# Altium project standos_RPi_com.PrjPcb
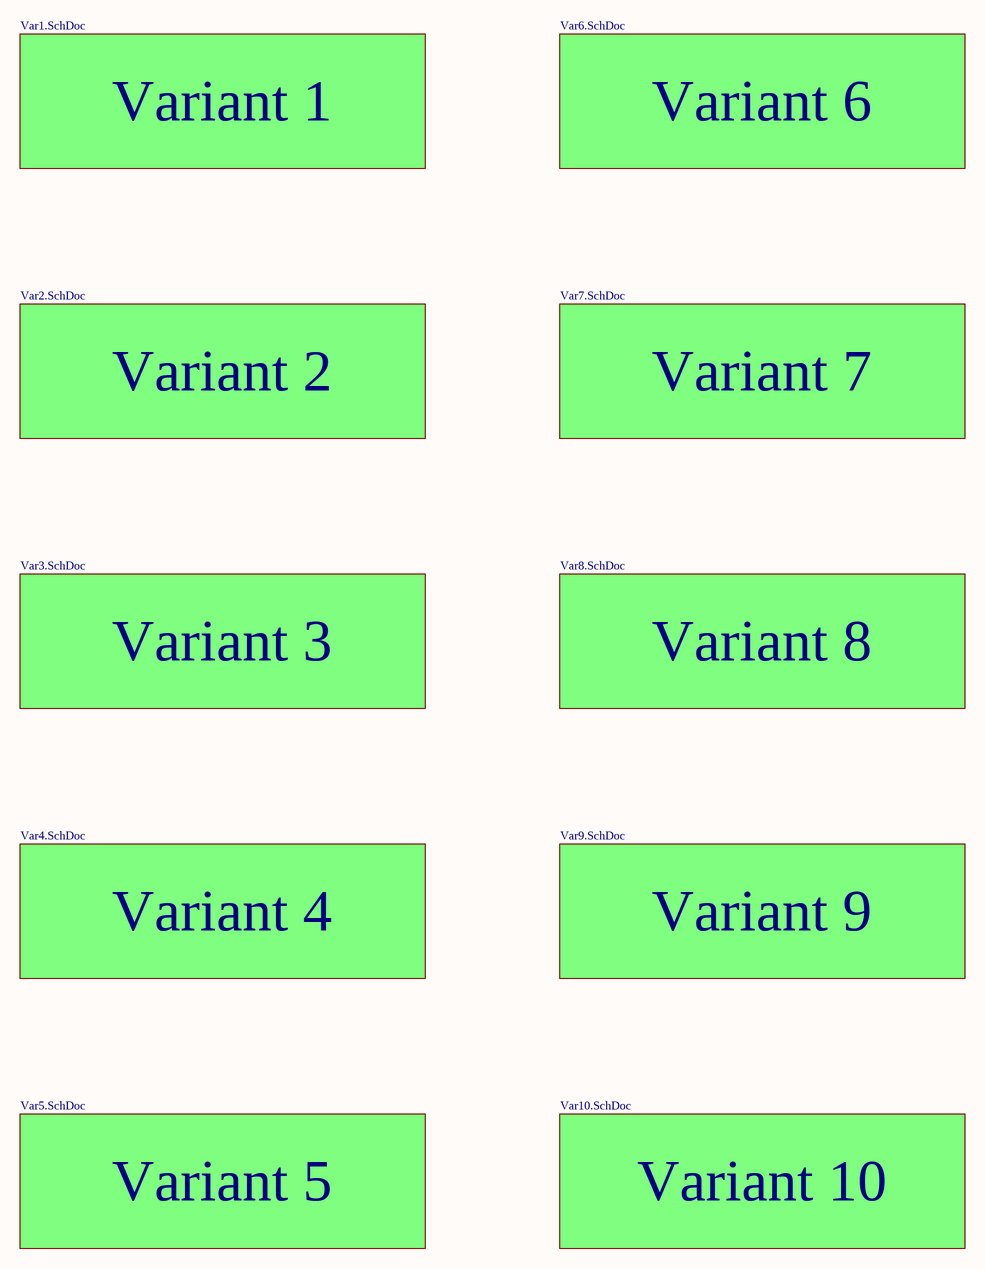
[diagram p0: Comnunication.SchDoc]
13 sheets, 32 parts. Net scope: flat (ports and power ports of the same name join across sheets).
Board file: standos_rpi_com.PcbDoc
Sheets:
  Comnunication.SchDoc
    Variant 1 = Var1.SchDoc
      Perph = Perph_connectors.SchDoc
      RPiCONN = RPi_connector.SchDoc
    Variant 2 = Var2.SchDoc
      RPiCONN = RPi_connector.SchDoc
      Perph = Perph_connectors.SchDoc
    Variant 3 = Var3.SchDoc
      RPiCONN = RPi_connector.SchDoc
      Perph = Perph_connectors.SchDoc
    Variant 4 = Var4.SchDoc
      RPiCONN = RPi_connector.SchDoc
      Perph = Perph_connectors.SchDoc
    Variant 5 = Var5.SchDoc
      RPiCONN = RPi_connector.SchDoc
      Perph = Perph_connectors.SchDoc
    Variant 6 = Var6.SchDoc
      RPiCONN = RPi_connector.SchDoc
      Perph = Perph_connectors.SchDoc
    Variant 7 = Var7.SchDoc
      RPiCONN = RPi_connector.SchDoc
      Perph = Perph_connectors.SchDoc
    Variant 8 = Var8.SchDoc
      RPiCONN = RPi_connector.SchDoc
      Perph = Perph_connectors.SchDoc
    Variant 9 = Var9.SchDoc
      RPiCONN = RPi_connector.SchDoc
      Perph = Perph_connectors.SchDoc
    Variant 10 = Var10.SchDoc
      RPiCONN = RPi_connector.SchDoc
      Perph = Perph_connectors.SchDoc

## Sheet Comnunication.SchDoc
size A3; SheetNumber: 1; SheetTotal: 13

### Sub-sheets
Variant 1 = Var1.SchDoc: no entries
Variant 2 = Var2.SchDoc: no entries
Variant 3 = Var3.SchDoc: no entries
Variant 4 = Var4.SchDoc: no entries
Variant 5 = Var5.SchDoc: no entries
Variant 6 = Var6.SchDoc: no entries
Variant 7 = Var7.SchDoc: no entries
Variant 8 = Var8.SchDoc: no entries
Variant 9 = Var9.SchDoc: no entries
Variant 10 = Var10.SchDoc: no entries

## Sheet Var1.SchDoc
size A4; SheetNumber: 2; SheetTotal: 12
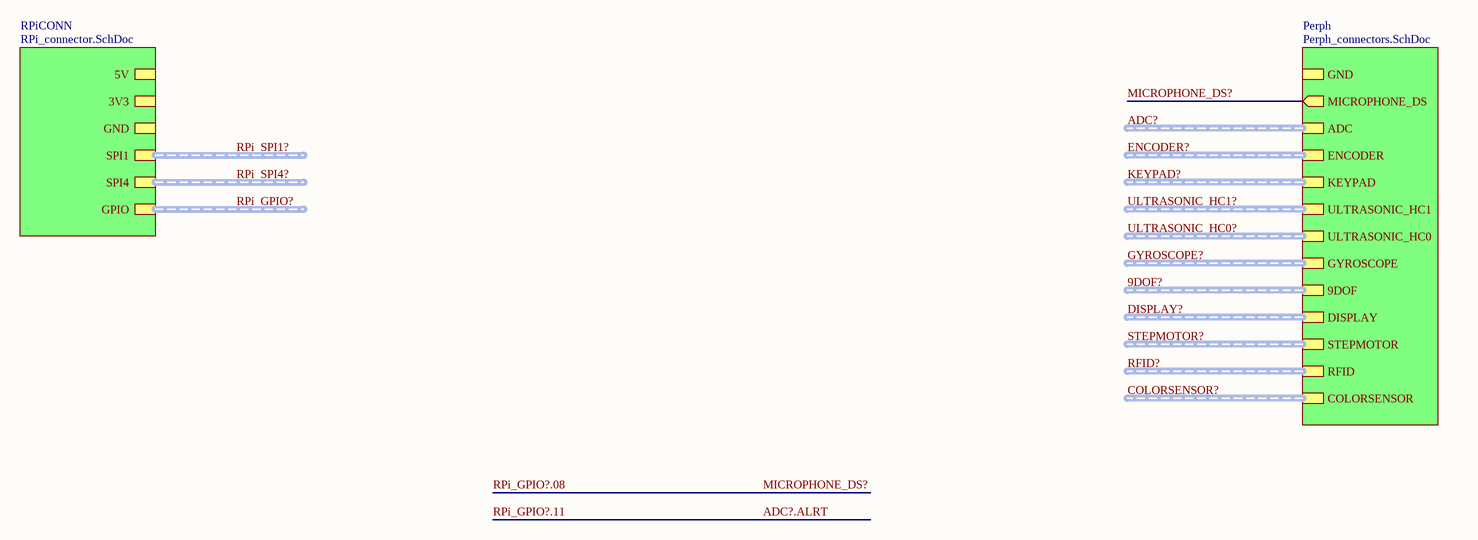
[diagram p1: Var1.SchDoc]

### Sub-sheets
Perph = Perph_connectors.SchDoc: MICROPHONE_DS (out), ADC (harness ADS1115 module), GYROSCOPE (harness GY-50 L3GD20 Gyro), ULTRASONIC_HC1 (harness HC-SR04), GND, KEYPAD (harness Keypad COM-08653), ULTRASONIC_HC0 (harness HC-SR04), DISPLAY (harness MSP3520), STEPMOTOR (harness ULN2003 Module), RFID (harness RC522), ENCODER (harness KY-040), COLORSENSOR (harness TCS34725), 9DOF (harness 9DOF)
RPiCONN = RPi_connector.SchDoc: 5V, 3V3, GND, SPI4 (harness SPI_2CS), SPI1 (harness SPI_3CS), GPIO (harness RPI_GPIO)

### Buses and harness runs
harness 9DOF? = sheet Perph/9DOF
harness ADC? = sheet Perph/ADC
harness COLORSENSOR? = sheet Perph/COLORSENSOR
harness DISPLAY? = sheet Perph/DISPLAY
harness ENCODER? = sheet Perph/ENCODER
harness GYROSCOPE? = sheet Perph/GYROSCOPE
harness KEYPAD? = sheet Perph/KEYPAD
harness RFID? = sheet Perph/RFID
harness RPi_GPIO? = sheet RPiCONN/GPIO
harness RPi_SPI1? = sheet RPiCONN/SPI1
harness RPi_SPI4? = sheet RPiCONN/SPI4
harness STEPMOTOR? = sheet Perph/STEPMOTOR
harness ULTRASONIC_HC0? = sheet Perph/ULTRASONIC_HC0
harness ULTRASONIC_HC1? = sheet Perph/ULTRASONIC_HC1

## Sheet Perph_connectors.SchDoc
size A4; SheetNumber: 4; SheetTotal: 12
Used 10 times, as channels Variant 1/Perph, Variant 2/Perph, Variant 3/Perph, Variant 4/Perph, Variant 5/Perph, Variant 6/Perph, Variant 7/Perph, Variant 8/Perph, Variant 9/Perph, Variant 10/Perph. Parts and nets are listed once, with the designators drawn on the sheet.
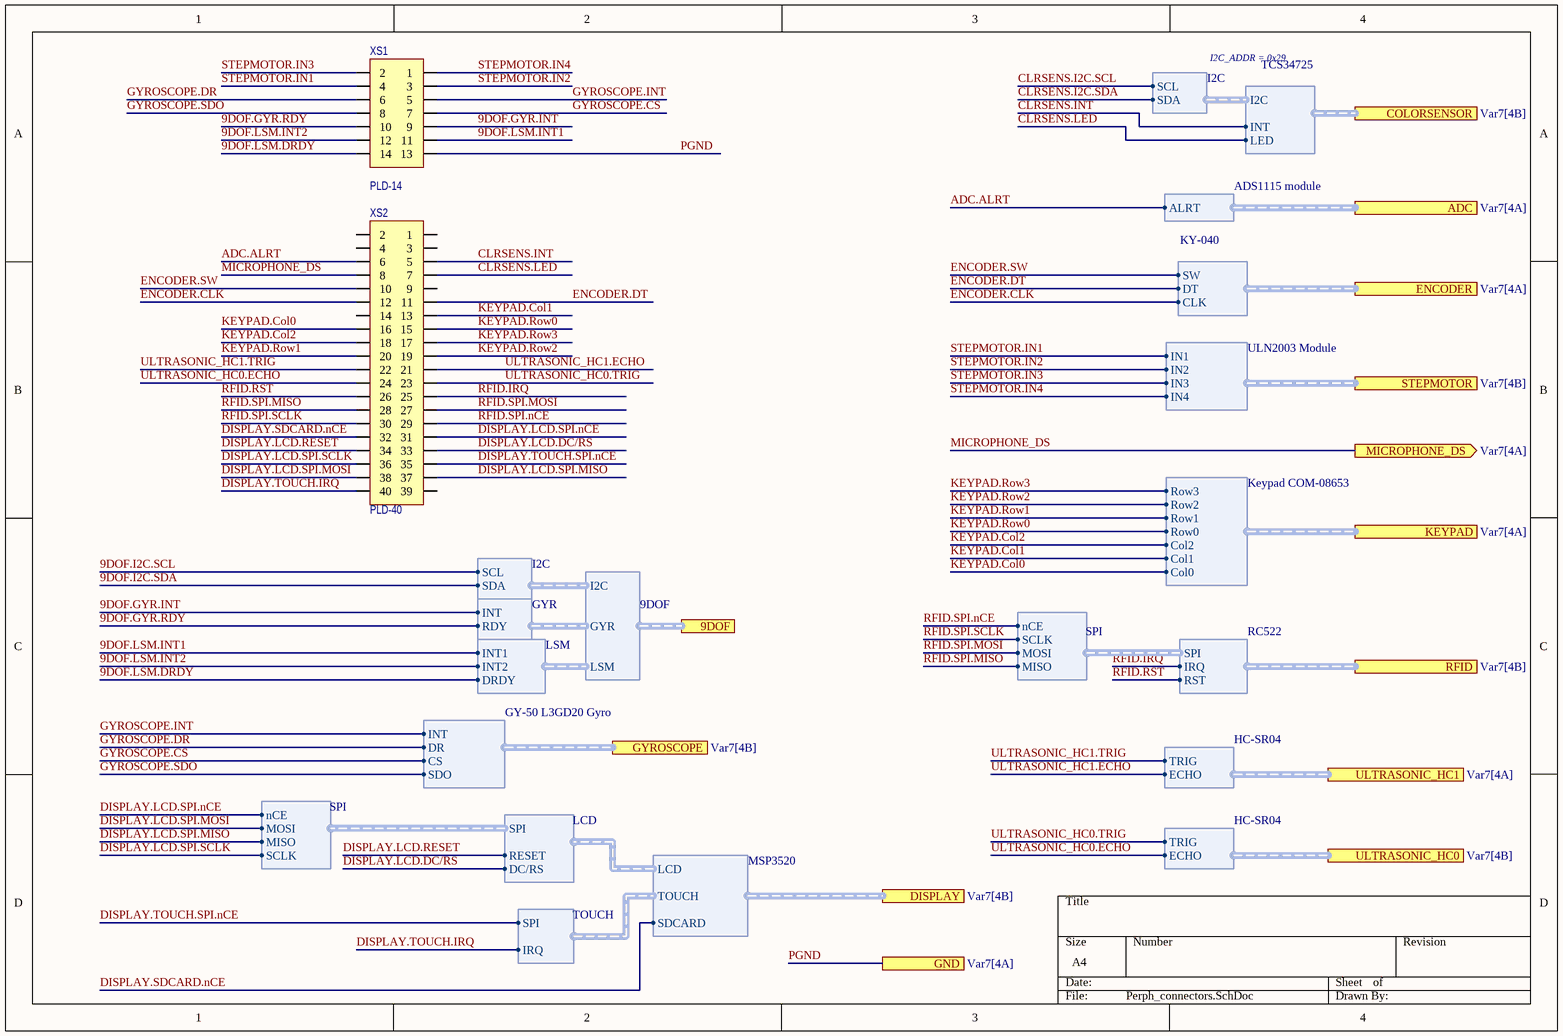
[diagram p2: Perph_connectors.SchDoc]

### Parts
XS1  PLD-14  [PBD-14]
XS2  PLD-40  [PLD-40]

### Ports
9DOF (harness 9DOF), ADC (harness ADS1115 module, see Var7[4A]), COLORSENSOR (harness TCS34725, see Var7[4B]), DISPLAY (harness MSP3520, see Var7[4B]), ENCODER (harness KY-040, see Var7[4A]), GND (see Var7[4A]), GYROSCOPE (harness GY-50 L3GD20 Gyro, see Var7[4B]), KEYPAD (harness Keypad COM-08653, see Var7[4A]), MICROPHONE_DS (out, see Var7[4A]), RFID (harness RC522, see Var7[4B]), STEPMOTOR (harness ULN2003 Module, see Var7[4B]), ULTRASONIC_HC0 (harness HC-SR04, see Var7[4B]), ULTRASONIC_HC1 (harness HC-SR04, see Var7[4A])

### Harnesses
ADS1115 module: ALRT
ULN2003 Module: IN1, IN2, IN3, IN4
RC522: IRQ, RST, SPI
SPI: nCE, MISO, MOSI, SCLK
Keypad COM-08653: Col0, Col1, Col2, Row0, Row1, Row2, Row3
GY-50 L3GD20 Gyro: SDO, CS, DR, INT
HC-SR04: ECHO, TRIG
LCD: SPI, RESET, DC/RS
TOUCH: SPI, IRQ
MSP3520: LCD, TOUCH, SDCARD
I2C: SCL, SDA
9DOF: I2C, GYR, LSM
GYR: INT, RDY
LSM: INT1, DRDY, INT2
TCS34725: I2C, INT, LED
KY-040: CLK, SW, DT

### Nets
9DOF.GYR.INT: XS1.9 ; harness GYR.INT
9DOF.GYR.RDY: XS1.10 ; harness GYR.RDY
9DOF.I2C.SCL: harness I2C.SCL
9DOF.I2C.SDA: harness I2C.SDA
9DOF.LSM.DRDY: XS1.14 ; harness LSM.DRDY
9DOF.LSM.INT1: XS1.11 ; harness LSM.INT1
9DOF.LSM.INT2: XS1.12 ; harness LSM.INT2
ADC.ALRT: XS2.6 ; port ADC.ALRT
CLRSENS.I2C.SCL: harness I2C.SCL
CLRSENS.I2C.SDA: harness I2C.SDA
CLRSENS.INT: XS2.5 ; port COLORSENSOR.INT
CLRSENS.LED: XS2.7
DISPLAY.LCD.DC/RS: XS2.33 ; harness LCD.DC/RS
DISPLAY.LCD.RESET: XS2.34 ; harness LCD.RESET
DISPLAY.LCD.SPI.MISO: XS2.37 ; harness SPI.MISO
DISPLAY.LCD.SPI.MOSI: XS2.38 ; harness SPI.MOSI
DISPLAY.LCD.SPI.nCE: XS2.31 ; harness SPI.nCE
DISPLAY.LCD.SPI.SCLK: XS2.36 ; harness SPI.SCLK
DISPLAY.SDCARD.nCE: XS2.32
DISPLAY.TOUCH.IRQ: XS2.40 ; harness TOUCH.IRQ
DISPLAY.TOUCH.SPI.nCE: XS2.35
ENCODER.CLK: XS2.12 ; port ENCODER.CLK
ENCODER.DT: XS2.11 ; port ENCODER.DT
ENCODER.SW: XS2.10 ; port ENCODER.SW
GYROSCOPE.CS: XS1.7 ; port GYROSCOPE.CS
GYROSCOPE.DR: XS1.6 ; port GYROSCOPE.DR
GYROSCOPE.INT: XS1.5 ; port GYROSCOPE.INT
GYROSCOPE.SDO: XS1.8 ; port GYROSCOPE.SDO
KEYPAD.Col0: XS2.16 ; port KEYPAD.Col0
KEYPAD.Col1: XS2.13 ; port KEYPAD.Col1
KEYPAD.Col2: XS2.18 ; port KEYPAD.Col2
KEYPAD.Row0: XS2.15 ; port KEYPAD.Row0
KEYPAD.Row1: XS2.20 ; port KEYPAD.Row1
KEYPAD.Row2: XS2.19 ; port KEYPAD.Row2
KEYPAD.Row3: XS2.17 ; port KEYPAD.Row3
MICROPHONE_DS: XS2.8 ; port MICROPHONE_DS
PGND: XS1.13 ; port GND
RFID.IRQ: XS2.25 ; port RFID.IRQ
RFID.RST: XS2.26 ; port RFID.RST
RFID.SPI.MISO: XS2.28 ; harness SPI.MISO
RFID.SPI.MOSI: XS2.27 ; harness SPI.MOSI
RFID.SPI.nCE: XS2.29 ; harness SPI.nCE
RFID.SPI.SCLK: XS2.30 ; harness SPI.SCLK
STEPMOTOR.IN1: XS1.4 ; port STEPMOTOR.IN1
STEPMOTOR.IN2: XS1.3 ; port STEPMOTOR.IN2
STEPMOTOR.IN3: XS1.2 ; port STEPMOTOR.IN3
STEPMOTOR.IN4: XS1.1 ; port STEPMOTOR.IN4
ULTRASONIC_HC0.ECHO: XS2.24 ; port ULTRASONIC_HC0.ECHO
ULTRASONIC_HC0.TRIG: XS2.23 ; port ULTRASONIC_HC0.TRIG
ULTRASONIC_HC1.ECHO: XS2.21 ; port ULTRASONIC_HC1.ECHO
ULTRASONIC_HC1.TRIG: XS2.22 ; port ULTRASONIC_HC1.TRIG

Not connected (* = marked no-connect by the designer): XS2 1 2 3 4 9 14 39

### Channels
Variant 1/Perph: designators end in _Perph1; ports GND=PGND MICROPHONE_DS=MICROPHONE_DS
Variant 2/Perph: designators end in _Perph2; ports GND=PGND MICROPHONE_DS=MICROPHONE_DS
Variant 3/Perph: designators end in _Perph3; ports GND=PGND MICROPHONE_DS=MICROPHONE_DS
Variant 4/Perph: designators end in _Perph4; ports GND=PGND MICROPHONE_DS=MICROPHONE_DS
Variant 5/Perph: designators end in _Perph5; ports GND=PGND MICROPHONE_DS=MICROPHONE_DS
Variant 6/Perph: designators end in _Perph6; ports GND=PGND MICROPHONE_DS=MICROPHONE_DS
Variant 7/Perph: designators end in _Perph7; ports GND=PGND MICROPHONE_DS=MICROPHONE_DS
Variant 8/Perph: designators end in _Perph8; ports GND=PGND MICROPHONE_DS=MICROPHONE_DS
Variant 9/Perph: designators end in _Perph9; ports GND=PGND MICROPHONE_DS=MICROPHONE_DS
Variant 10/Perph: designators end in _Perph10; ports GND=PGND MICROPHONE_DS=MICROPHONE_DS

### Notes on the sheet
- I2C_ADDR = 0x29

## Sheet RPi_connector.SchDoc
size A4; SheetNumber: 3; SheetTotal: 12
Used 10 times, as channels Variant 1/RPiCONN, Variant 2/RPiCONN, Variant 3/RPiCONN, Variant 4/RPiCONN, Variant 5/RPiCONN, Variant 6/RPiCONN, Variant 7/RPiCONN, Variant 8/RPiCONN, Variant 9/RPiCONN, Variant 10/RPiCONN. Parts and nets are listed once, with the designators drawn on the sheet.
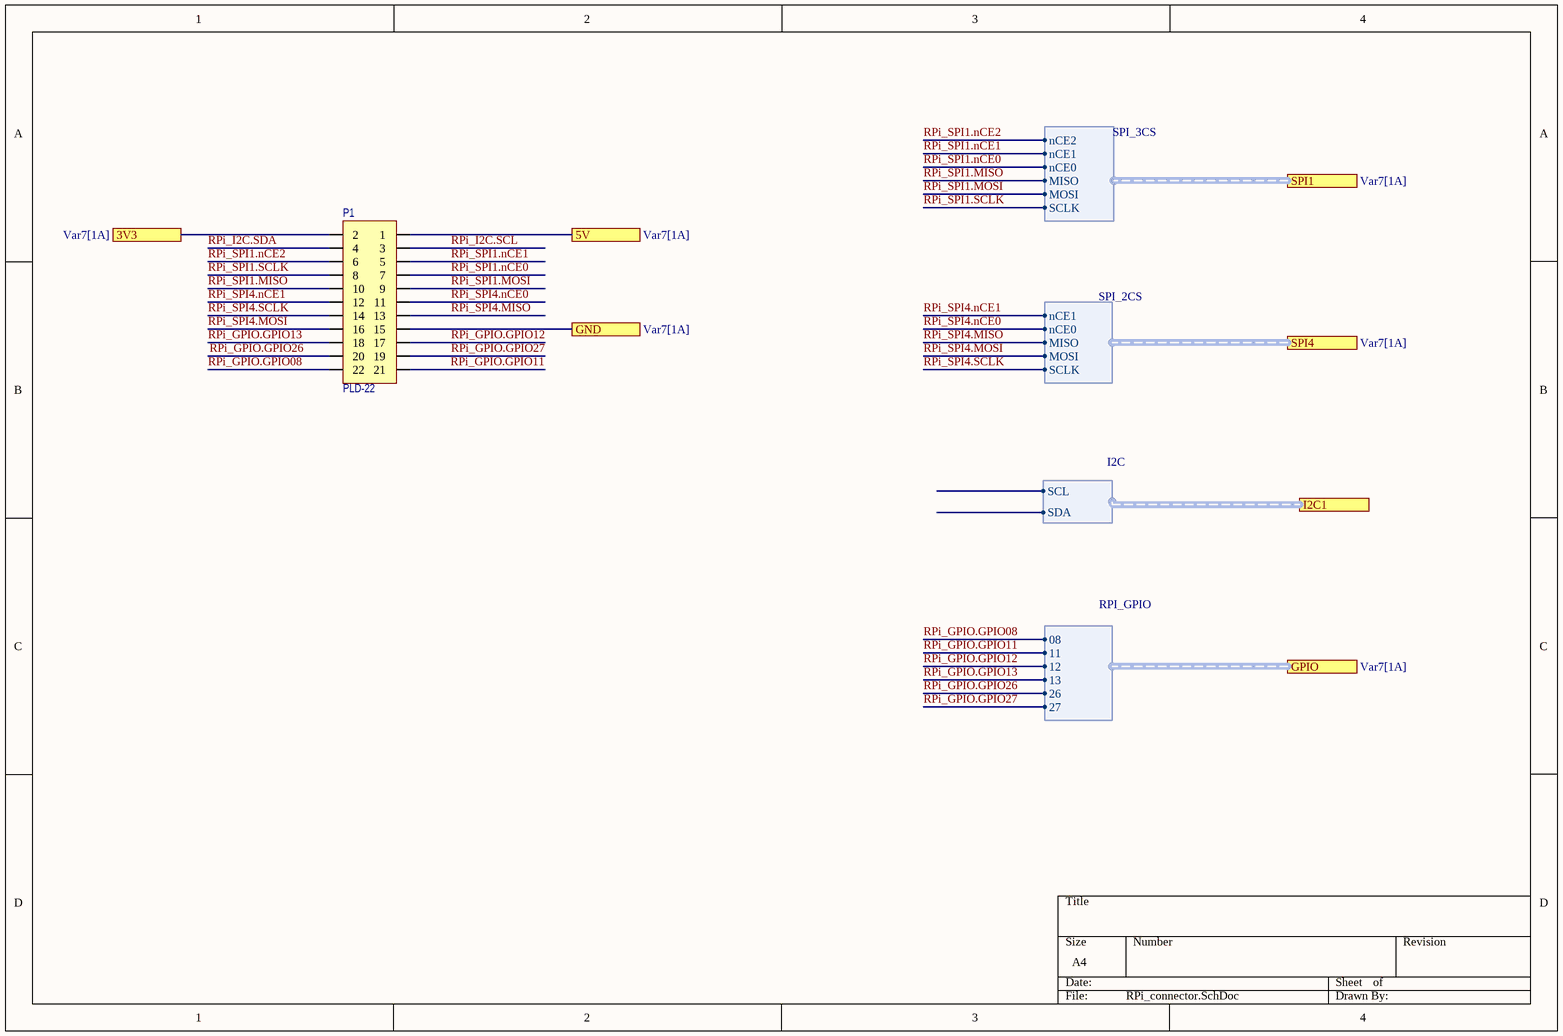
[diagram p3: RPi_connector.SchDoc]

### Parts
P1  PLD-22  [PLD-22]

### Ports
3V3 (see Var7[1A]), 5V (see Var7[1A]), GND (see Var7[1A]), GPIO (harness RPI_GPIO, see Var7[1A]), I2C1 (harness I2C), SPI1 (harness SPI_3CS, see Var7[1A]), SPI4 (harness SPI_2CS, see Var7[1A])

### Harnesses
RPI_GPIO: 08, 11, 26, 27, 12, 13
SPI_2CS: nCE1, nCE0, MISO, MOSI, SCLK
SPI_3CS: MISO, MOSI, nCE0, nCE1, nCE2, SCLK
I2C: SCL, SDA

### Nets
3V3: P1.2 ; port 3V3
5V: P1.1 ; port 5V
GND: P1.15 ; port GND
RPi_GPIO.GPIO08: P1.22 ; port GPIO.08
RPi_GPIO.GPIO11: P1.21 ; port GPIO.11
RPi_GPIO.GPIO12: P1.17 ; port GPIO.12
RPi_GPIO.GPIO13: P1.18 ; port GPIO.13
RPi_GPIO.GPIO26: P1.20 ; port GPIO.26
RPi_GPIO.GPIO27: P1.19 ; port GPIO.27
RPi_I2C.SCL: P1.3
RPi_I2C.SDA: P1.4
RPi_SPI1.MISO: P1.10 ; port SPI1.MISO
RPi_SPI1.MOSI: P1.9 ; port SPI1.MOSI
RPi_SPI1.nCE0: P1.7 ; port SPI1.nCE0
RPi_SPI1.nCE1: P1.5 ; port SPI1.nCE1
RPi_SPI1.nCE2: P1.6 ; port SPI1.nCE2
RPi_SPI1.SCLK: P1.8 ; port SPI1.SCLK
RPi_SPI4.MISO: P1.13 ; port SPI4.MISO
RPi_SPI4.MOSI: P1.16 ; port SPI4.MOSI
RPi_SPI4.nCE0: P1.11 ; port SPI4.nCE0
RPi_SPI4.nCE1: P1.12 ; port SPI4.nCE1
RPi_SPI4.SCLK: P1.14 ; port SPI4.SCLK

### Channels
Variant 1/RPiCONN: designators end in _RPiCONN1; ports 3V3=NetP1_RPiCONN1_2 5V=NetP1_RPiCONN1_1 GND=PGND
Variant 2/RPiCONN: designators end in _RPiCONN2; ports 3V3=NetP1_RPiCONN1_2 5V=NetP1_RPiCONN1_1 GND=PGND
Variant 3/RPiCONN: designators end in _RPiCONN3; ports 3V3=NetP1_RPiCONN1_2 5V=NetP1_RPiCONN1_1 GND=PGND
Variant 4/RPiCONN: designators end in _RPiCONN4; ports 3V3=NetP1_RPiCONN1_2 5V=NetP1_RPiCONN1_1 GND=PGND
Variant 5/RPiCONN: designators end in _RPiCONN5; ports 3V3=NetP1_RPiCONN1_2 5V=NetP1_RPiCONN1_1 GND=PGND
Variant 6/RPiCONN: designators end in _RPiCONN6; ports 3V3=NetP1_RPiCONN1_2 5V=NetP1_RPiCONN1_1 GND=PGND
Variant 7/RPiCONN: designators end in _RPiCONN7; ports 3V3=NetP1_RPiCONN1_2 5V=NetP1_RPiCONN1_1 GND=PGND
Variant 8/RPiCONN: designators end in _RPiCONN8; ports 3V3=NetP1_RPiCONN1_2 5V=NetP1_RPiCONN1_1 GND=PGND
Variant 9/RPiCONN: designators end in _RPiCONN9; ports 3V3=NetP1_RPiCONN1_2 5V=NetP1_RPiCONN1_1 GND=PGND
Variant 10/RPiCONN: designators end in _RPiCONN10; ports 3V3=NetP1_RPiCONN1_2 5V=NetP1_RPiCONN1_1 GND=PGND

## Sheet Var2.SchDoc
size A4; SheetNumber: 5; SheetTotal: 12
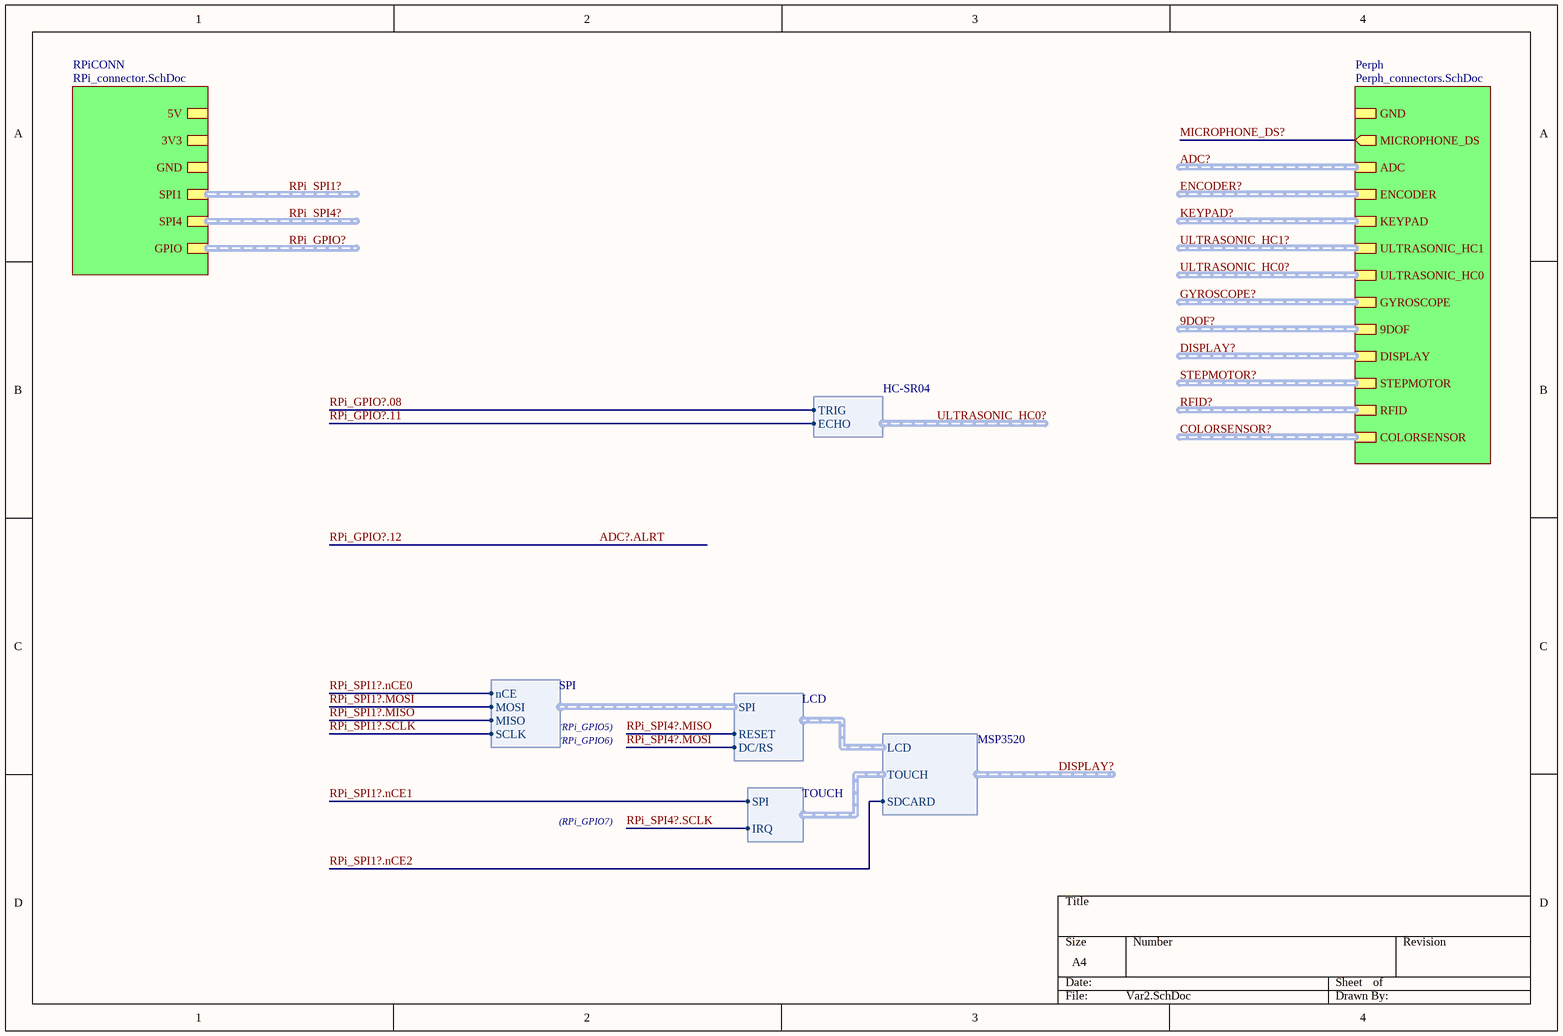
[diagram p4: Var2.SchDoc]

### Sub-sheets
Perph = Perph_connectors.SchDoc: MICROPHONE_DS (out), ADC (harness ADS1115 module), GYROSCOPE (harness GY-50 L3GD20 Gyro), ULTRASONIC_HC1 (harness HC-SR04), GND, KEYPAD (harness Keypad COM-08653), ULTRASONIC_HC0 (harness HC-SR04), DISPLAY (harness MSP3520), STEPMOTOR (harness ULN2003 Module), RFID (harness RC522), ENCODER (harness KY-040), COLORSENSOR (harness TCS34725), 9DOF (harness 9DOF)
RPiCONN = RPi_connector.SchDoc: 5V, 3V3, GND, SPI4 (harness SPI_2CS), SPI1 (harness SPI_3CS), GPIO (harness RPI_GPIO)

### Harnesses
HC-SR04: ECHO, TRIG
SPI: nCE, MISO, MOSI, SCLK
LCD: SPI, RESET, DC/RS
TOUCH: SPI, IRQ
MSP3520: LCD, TOUCH, SDCARD

### Buses and harness runs
harness 9DOF? = sheet Perph/9DOF
harness ADC? = sheet Perph/ADC
harness COLORSENSOR? = sheet Perph/COLORSENSOR
harness DISPLAY? = sheet Perph/DISPLAY
harness ENCODER? = sheet Perph/ENCODER
harness GYROSCOPE? = sheet Perph/GYROSCOPE
harness KEYPAD? = sheet Perph/KEYPAD
harness RFID? = sheet Perph/RFID
harness RPi_GPIO? = sheet RPiCONN/GPIO
harness RPi_SPI1? = sheet RPiCONN/SPI1
harness RPi_SPI4? = sheet RPiCONN/SPI4
harness STEPMOTOR? = sheet Perph/STEPMOTOR
harness ULTRASONIC_HC0? = sheet Perph/ULTRASONIC_HC0
harness ULTRASONIC_HC1? = sheet Perph/ULTRASONIC_HC1

### Notes on the sheet
- (RPi_GPIO5)
- (RPi_GPIO6)
- (RPi_GPIO7)

## Sheet Var3.SchDoc
size A4; SheetNumber: 6; SheetTotal: 12
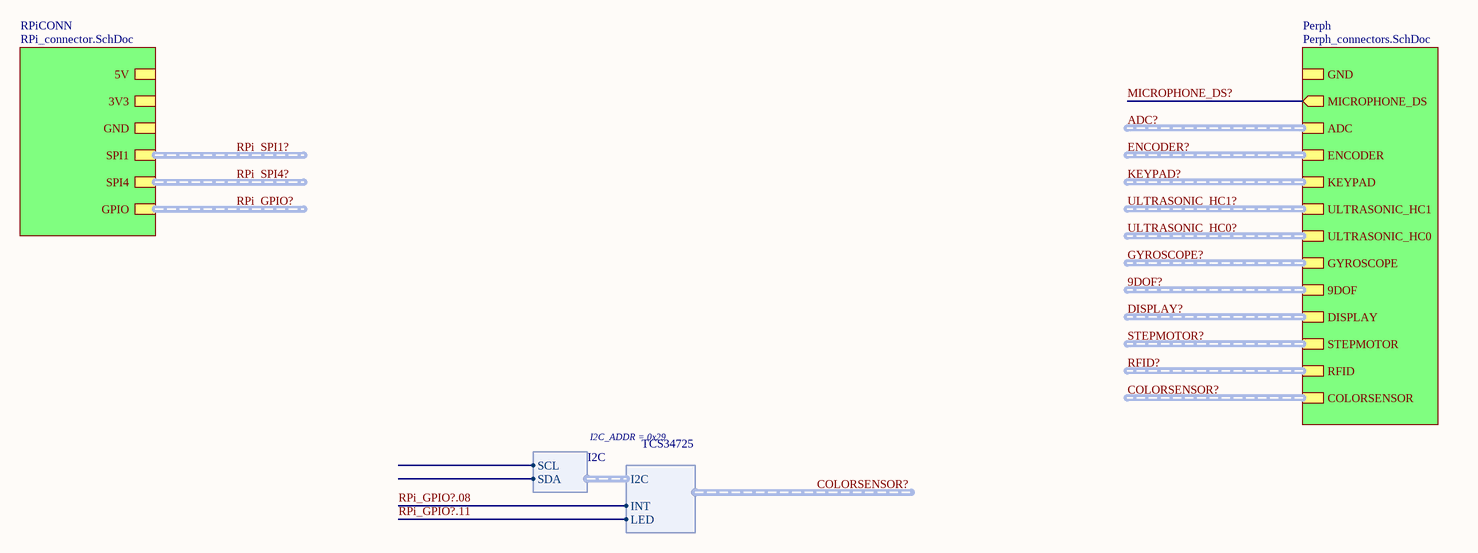
[diagram p5: Var3.SchDoc]

### Sub-sheets
Perph = Perph_connectors.SchDoc: MICROPHONE_DS (out), ADC (harness ADS1115 module), GYROSCOPE (harness GY-50 L3GD20 Gyro), ULTRASONIC_HC1 (harness HC-SR04), GND, KEYPAD (harness Keypad COM-08653), ULTRASONIC_HC0 (harness HC-SR04), DISPLAY (harness MSP3520), STEPMOTOR (harness ULN2003 Module), RFID (harness RC522), ENCODER (harness KY-040), COLORSENSOR (harness TCS34725), 9DOF (harness 9DOF)
RPiCONN = RPi_connector.SchDoc: 5V, 3V3, GND, SPI4 (harness SPI_2CS), SPI1 (harness SPI_3CS), GPIO (harness RPI_GPIO)

### Harnesses
TCS34725: I2C, INT, LED
I2C: SCL, SDA

### Buses and harness runs
harness 9DOF? = sheet Perph/9DOF
harness ADC? = sheet Perph/ADC
harness COLORSENSOR? = sheet Perph/COLORSENSOR
harness DISPLAY? = sheet Perph/DISPLAY
harness ENCODER? = sheet Perph/ENCODER
harness GYROSCOPE? = sheet Perph/GYROSCOPE
harness KEYPAD? = sheet Perph/KEYPAD
harness RFID? = sheet Perph/RFID
harness RPi_GPIO? = sheet RPiCONN/GPIO
harness RPi_SPI1? = sheet RPiCONN/SPI1
harness RPi_SPI4? = sheet RPiCONN/SPI4
harness STEPMOTOR? = sheet Perph/STEPMOTOR
harness ULTRASONIC_HC0? = sheet Perph/ULTRASONIC_HC0
harness ULTRASONIC_HC1? = sheet Perph/ULTRASONIC_HC1

### Notes on the sheet
- I2C_ADDR = 0x29

## Sheet Var4.SchDoc
size A4; SheetNumber: 7; SheetTotal: 12
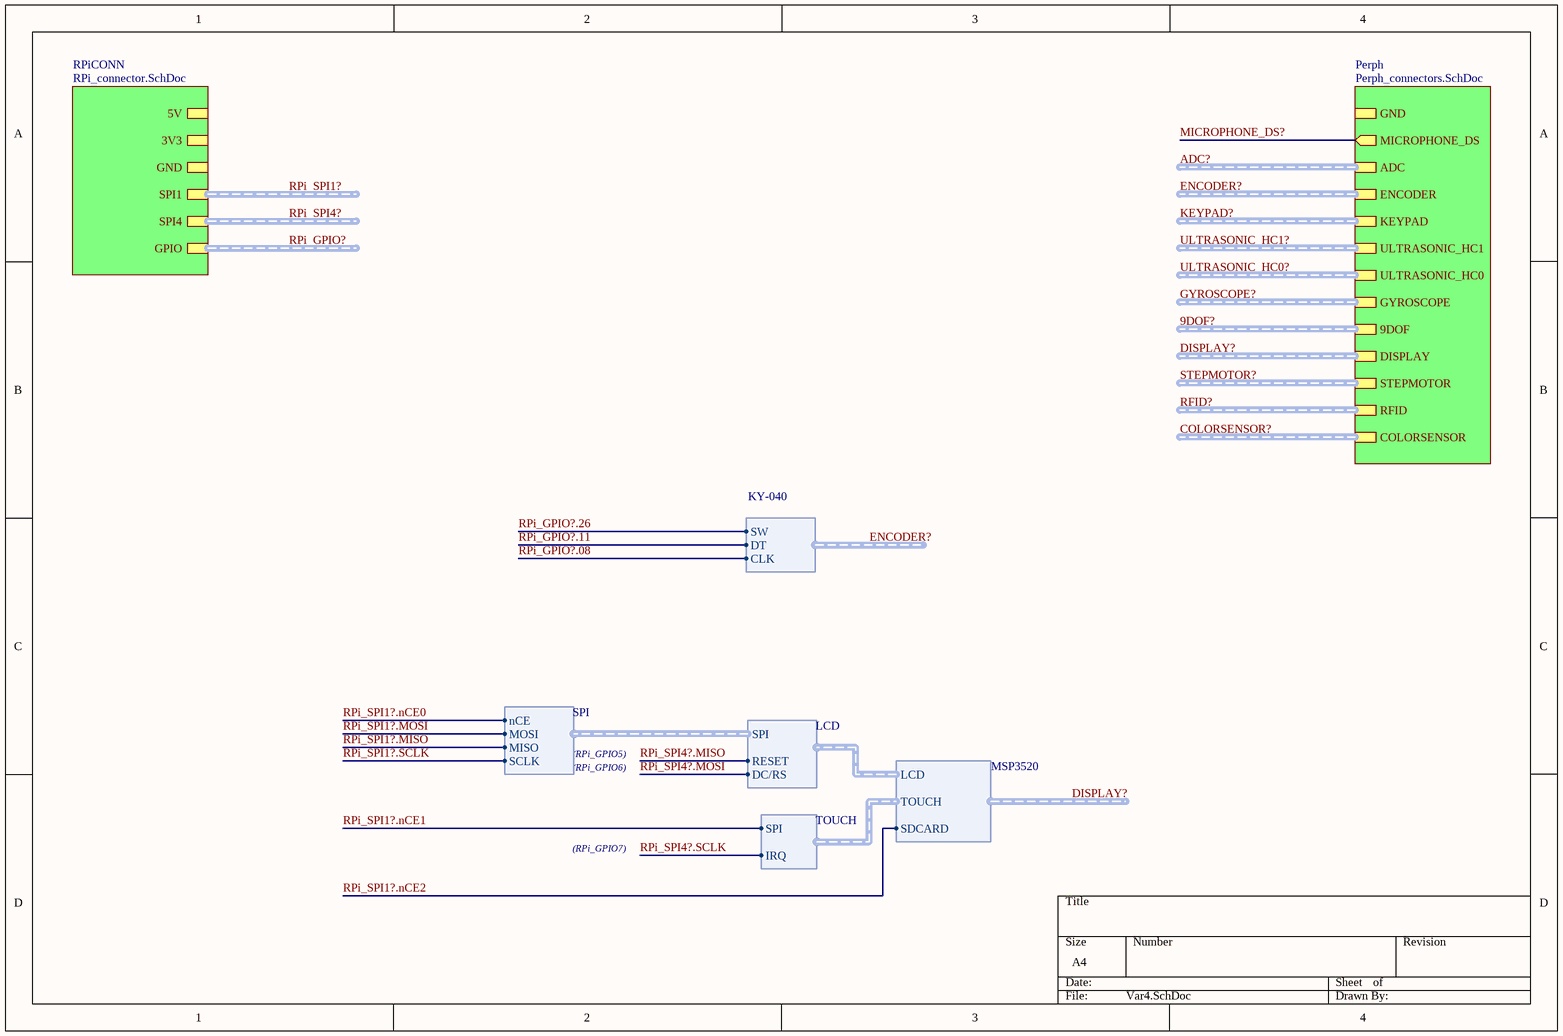
[diagram p6: Var4.SchDoc]

### Sub-sheets
Perph = Perph_connectors.SchDoc: MICROPHONE_DS (out), ADC (harness ADS1115 module), GYROSCOPE (harness GY-50 L3GD20 Gyro), ULTRASONIC_HC1 (harness HC-SR04), GND, KEYPAD (harness Keypad COM-08653), ULTRASONIC_HC0 (harness HC-SR04), DISPLAY (harness MSP3520), STEPMOTOR (harness ULN2003 Module), RFID (harness RC522), ENCODER (harness KY-040), COLORSENSOR (harness TCS34725), 9DOF (harness 9DOF)
RPiCONN = RPi_connector.SchDoc: 5V, 3V3, GND, SPI4 (harness SPI_2CS), SPI1 (harness SPI_3CS), GPIO (harness RPI_GPIO)

### Harnesses
SPI: nCE, MISO, MOSI, SCLK
LCD: SPI, RESET, DC/RS
TOUCH: SPI, IRQ
MSP3520: LCD, TOUCH, SDCARD
KY-040: CLK, SW, DT

### Buses and harness runs
harness 9DOF? = sheet Perph/9DOF
harness ADC? = sheet Perph/ADC
harness COLORSENSOR? = sheet Perph/COLORSENSOR
harness DISPLAY? = sheet Perph/DISPLAY
harness ENCODER? = sheet Perph/ENCODER
harness GYROSCOPE? = sheet Perph/GYROSCOPE
harness KEYPAD? = sheet Perph/KEYPAD
harness RFID? = sheet Perph/RFID
harness RPi_GPIO? = sheet RPiCONN/GPIO
harness RPi_SPI1? = sheet RPiCONN/SPI1
harness RPi_SPI4? = sheet RPiCONN/SPI4
harness STEPMOTOR? = sheet Perph/STEPMOTOR
harness ULTRASONIC_HC0? = sheet Perph/ULTRASONIC_HC0
harness ULTRASONIC_HC1? = sheet Perph/ULTRASONIC_HC1

### Notes on the sheet
- (RPi_GPIO5)
- (RPi_GPIO6)
- (RPi_GPIO7)

## Sheet Var5.SchDoc
size A4; SheetNumber: 8; SheetTotal: 12
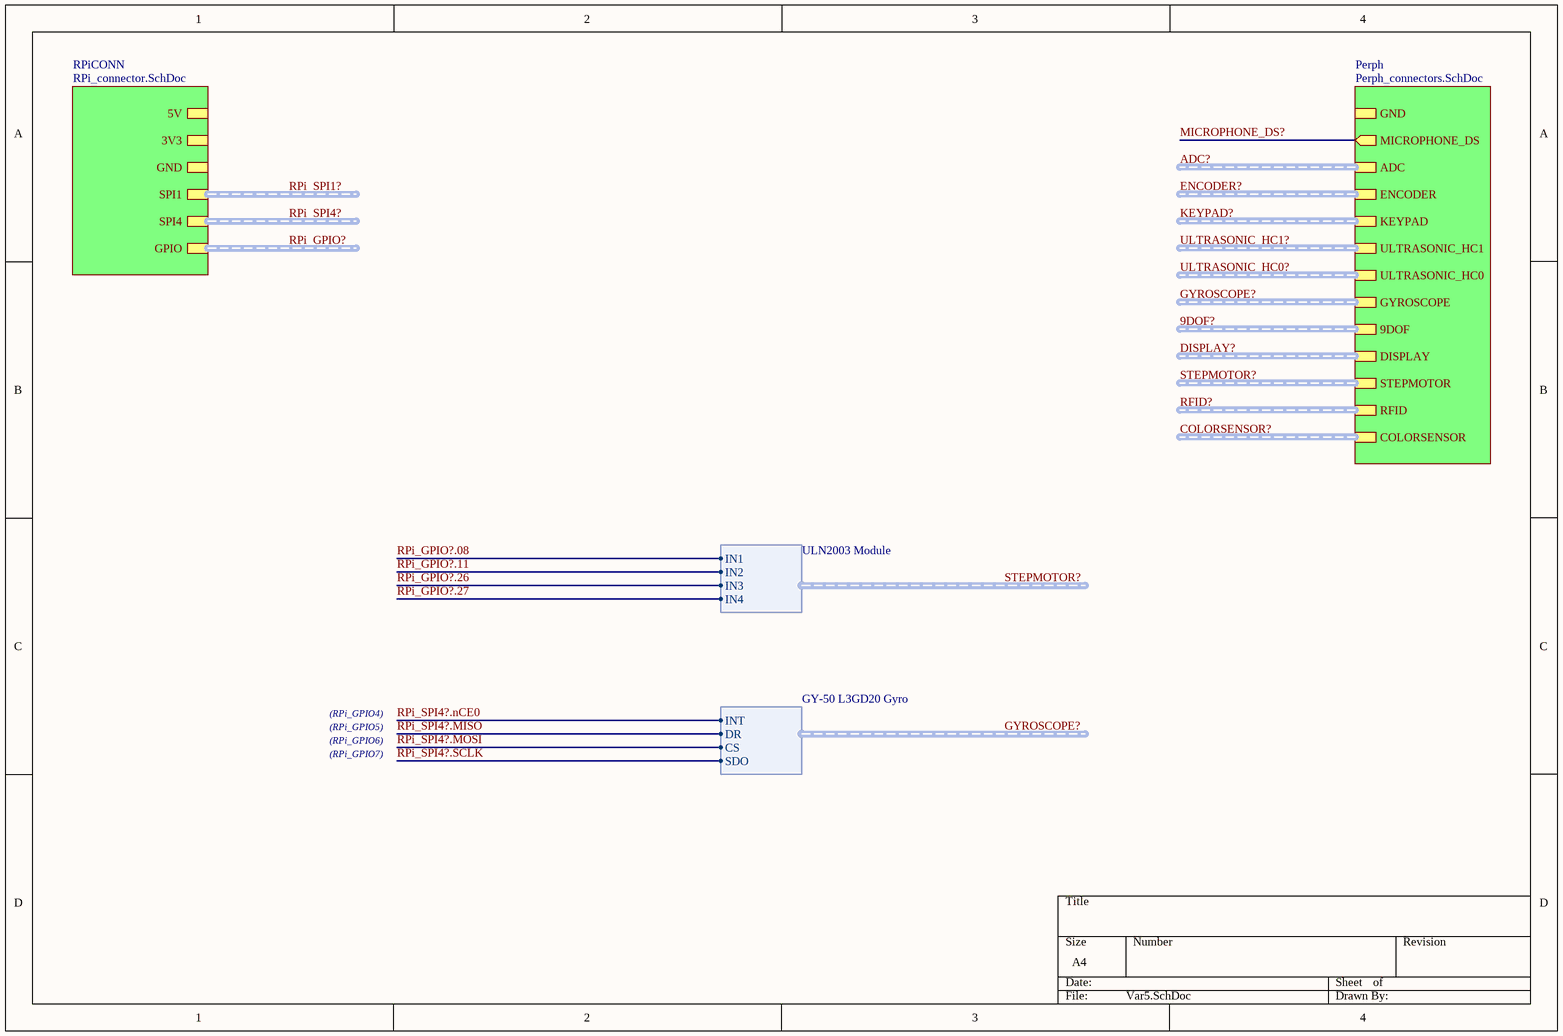
[diagram p7: Var5.SchDoc]

### Sub-sheets
Perph = Perph_connectors.SchDoc: MICROPHONE_DS (out), ADC (harness ADS1115 module), GYROSCOPE (harness GY-50 L3GD20 Gyro), ULTRASONIC_HC1 (harness HC-SR04), GND, KEYPAD (harness Keypad COM-08653), ULTRASONIC_HC0 (harness HC-SR04), DISPLAY (harness MSP3520), STEPMOTOR (harness ULN2003 Module), RFID (harness RC522), ENCODER (harness KY-040), COLORSENSOR (harness TCS34725), 9DOF (harness 9DOF)
RPiCONN = RPi_connector.SchDoc: 5V, 3V3, GND, SPI4 (harness SPI_2CS), SPI1 (harness SPI_3CS), GPIO (harness RPI_GPIO)

### Harnesses
ULN2003 Module: IN1, IN2, IN3, IN4
GY-50 L3GD20 Gyro: SDO, CS, DR, INT

### Buses and harness runs
harness 9DOF? = sheet Perph/9DOF
harness ADC? = sheet Perph/ADC
harness COLORSENSOR? = sheet Perph/COLORSENSOR
harness DISPLAY? = sheet Perph/DISPLAY
harness ENCODER? = sheet Perph/ENCODER
harness GYROSCOPE? = sheet Perph/GYROSCOPE
harness KEYPAD? = sheet Perph/KEYPAD
harness RFID? = sheet Perph/RFID
harness RPi_GPIO? = sheet RPiCONN/GPIO
harness RPi_SPI1? = sheet RPiCONN/SPI1
harness RPi_SPI4? = sheet RPiCONN/SPI4
harness STEPMOTOR? = sheet Perph/STEPMOTOR
harness ULTRASONIC_HC0? = sheet Perph/ULTRASONIC_HC0
harness ULTRASONIC_HC1? = sheet Perph/ULTRASONIC_HC1

### Notes on the sheet
- (RPi_GPIO4)
- (RPi_GPIO5)
- (RPi_GPIO6)
- (RPi_GPIO7)

## Sheet Var6.SchDoc
size A4; SheetNumber: 9; SheetTotal: 12
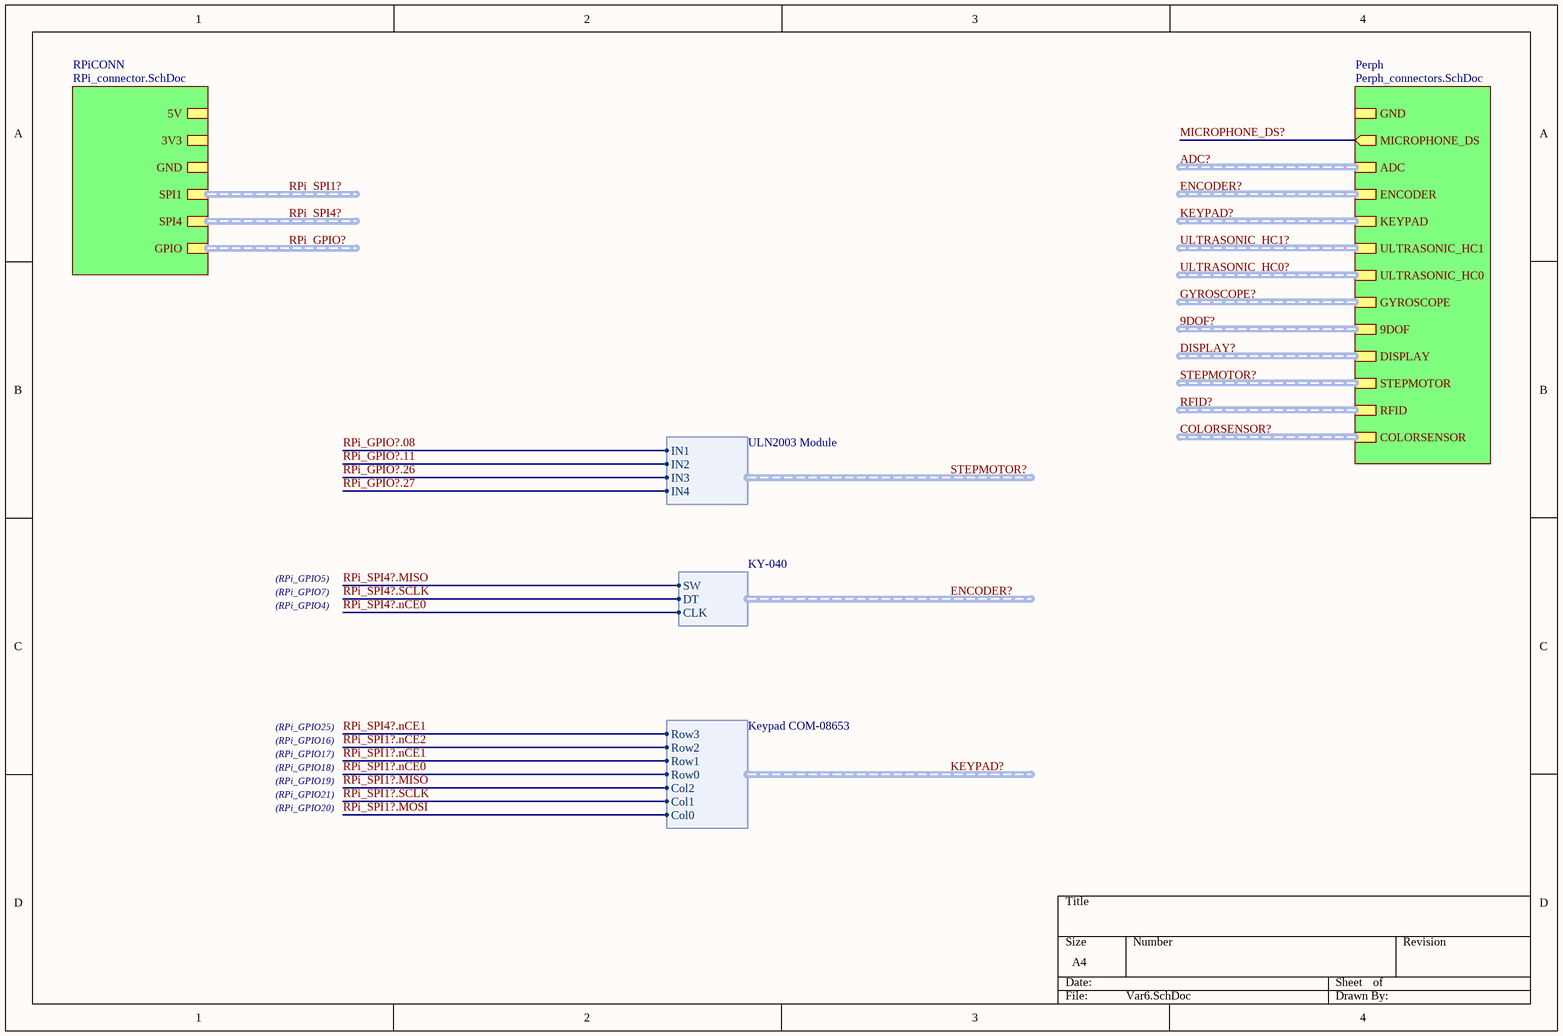
[diagram p8: Var6.SchDoc]

### Sub-sheets
Perph = Perph_connectors.SchDoc: MICROPHONE_DS (out), ADC (harness ADS1115 module), GYROSCOPE (harness GY-50 L3GD20 Gyro), ULTRASONIC_HC1 (harness HC-SR04), GND, KEYPAD (harness Keypad COM-08653), ULTRASONIC_HC0 (harness HC-SR04), DISPLAY (harness MSP3520), STEPMOTOR (harness ULN2003 Module), RFID (harness RC522), ENCODER (harness KY-040), COLORSENSOR (harness TCS34725), 9DOF (harness 9DOF)
RPiCONN = RPi_connector.SchDoc: 5V, 3V3, GND, SPI4 (harness SPI_2CS), SPI1 (harness SPI_3CS), GPIO (harness RPI_GPIO)

### Harnesses
ULN2003 Module: IN1, IN2, IN3, IN4
Keypad COM-08653: Col0, Col1, Col2, Row0, Row1, Row2, Row3
KY-040: CLK, SW, DT

### Buses and harness runs
harness 9DOF? = sheet Perph/9DOF
harness ADC? = sheet Perph/ADC
harness COLORSENSOR? = sheet Perph/COLORSENSOR
harness DISPLAY? = sheet Perph/DISPLAY
harness ENCODER? = sheet Perph/ENCODER
harness GYROSCOPE? = sheet Perph/GYROSCOPE
harness KEYPAD? = sheet Perph/KEYPAD
harness RFID? = sheet Perph/RFID
harness RPi_GPIO? = sheet RPiCONN/GPIO
harness RPi_SPI1? = sheet RPiCONN/SPI1
harness RPi_SPI4? = sheet RPiCONN/SPI4
harness STEPMOTOR? = sheet Perph/STEPMOTOR
harness ULTRASONIC_HC0? = sheet Perph/ULTRASONIC_HC0
harness ULTRASONIC_HC1? = sheet Perph/ULTRASONIC_HC1

### Notes on the sheet
- (RPi_GPIO5)
- (RPi_GPIO4)
- (RPi_GPIO7)
- (RPi_GPIO25)
- (RPi_GPIO16)
- (RPi_GPIO17)
- (RPi_GPIO18)
- (RPi_GPIO19)
- (RPi_GPIO20)
- (RPi_GPIO21)

## Sheet Var7.SchDoc
size A4; SheetNumber: 10; SheetTotal: 12
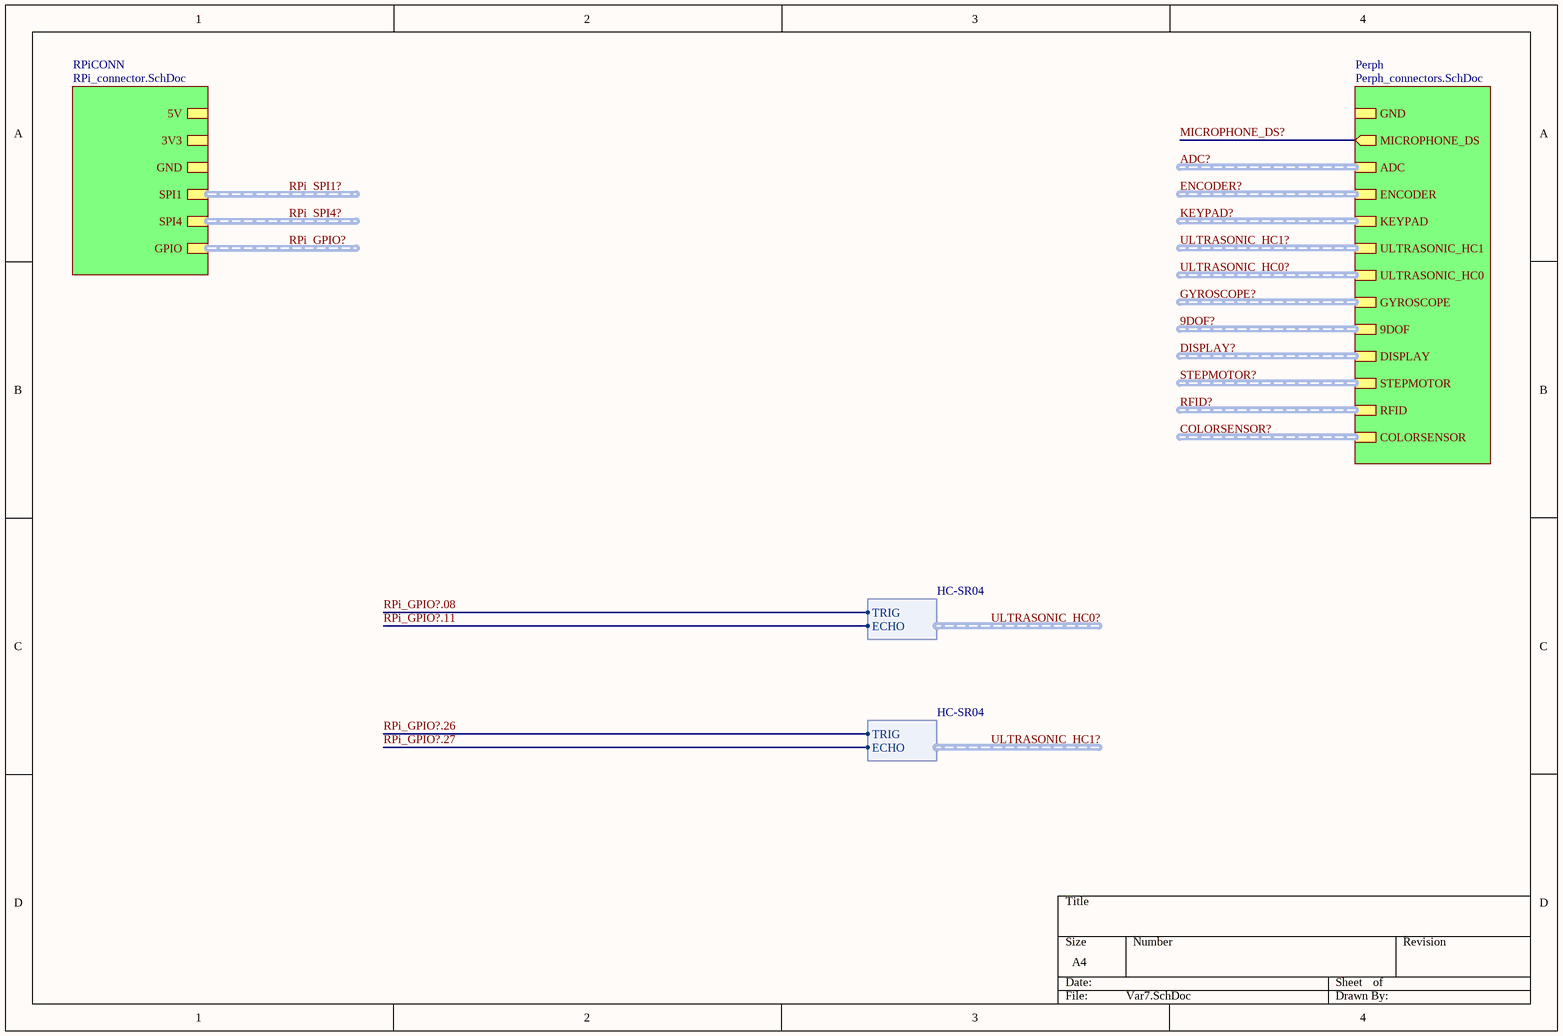
[diagram p9: Var7.SchDoc]

### Sub-sheets
Perph = Perph_connectors.SchDoc: MICROPHONE_DS (out), ADC (harness ADS1115 module), GYROSCOPE (harness GY-50 L3GD20 Gyro), ULTRASONIC_HC1 (harness HC-SR04), GND, KEYPAD (harness Keypad COM-08653), ULTRASONIC_HC0 (harness HC-SR04), DISPLAY (harness MSP3520), STEPMOTOR (harness ULN2003 Module), RFID (harness RC522), ENCODER (harness KY-040), COLORSENSOR (harness TCS34725), 9DOF (harness 9DOF)
RPiCONN = RPi_connector.SchDoc: 5V, 3V3, GND, SPI4 (harness SPI_2CS), SPI1 (harness SPI_3CS), GPIO (harness RPI_GPIO)

### Harnesses
HC-SR04: ECHO, TRIG

### Buses and harness runs
harness 9DOF? = sheet Perph/9DOF
harness ADC? = sheet Perph/ADC
harness COLORSENSOR? = sheet Perph/COLORSENSOR
harness DISPLAY? = sheet Perph/DISPLAY
harness ENCODER? = sheet Perph/ENCODER
harness GYROSCOPE? = sheet Perph/GYROSCOPE
harness KEYPAD? = sheet Perph/KEYPAD
harness RFID? = sheet Perph/RFID
harness RPi_GPIO? = sheet RPiCONN/GPIO
harness RPi_SPI1? = sheet RPiCONN/SPI1
harness RPi_SPI4? = sheet RPiCONN/SPI4
harness STEPMOTOR? = sheet Perph/STEPMOTOR
harness ULTRASONIC_HC0? = sheet Perph/ULTRASONIC_HC0
harness ULTRASONIC_HC1? = sheet Perph/ULTRASONIC_HC1

## Sheet Var8.SchDoc
size A4; SheetNumber: 11; SheetTotal: 12
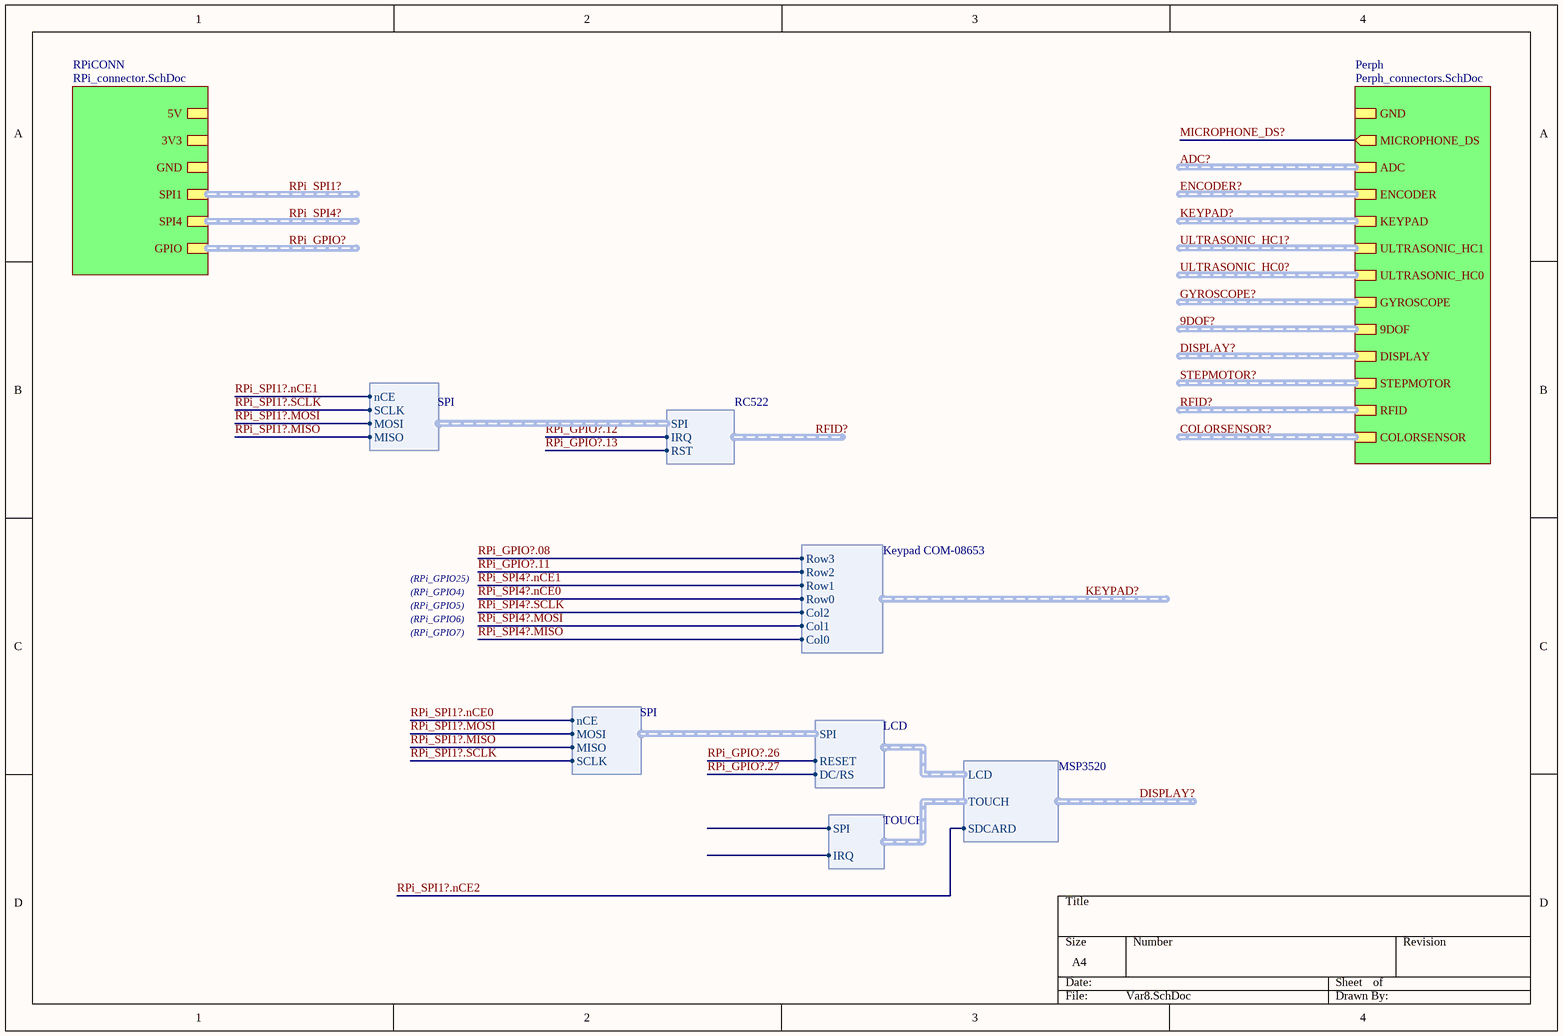
[diagram p10: Var8.SchDoc]

### Sub-sheets
Perph = Perph_connectors.SchDoc: MICROPHONE_DS (out), ADC (harness ADS1115 module), GYROSCOPE (harness GY-50 L3GD20 Gyro), ULTRASONIC_HC1 (harness HC-SR04), GND, KEYPAD (harness Keypad COM-08653), ULTRASONIC_HC0 (harness HC-SR04), DISPLAY (harness MSP3520), STEPMOTOR (harness ULN2003 Module), RFID (harness RC522), ENCODER (harness KY-040), COLORSENSOR (harness TCS34725), 9DOF (harness 9DOF)
RPiCONN = RPi_connector.SchDoc: 5V, 3V3, GND, SPI4 (harness SPI_2CS), SPI1 (harness SPI_3CS), GPIO (harness RPI_GPIO)

### Harnesses
SPI: nCE, MISO, MOSI, SCLK
LCD: SPI, RESET, DC/RS
MSP3520: LCD, TOUCH, SDCARD
Keypad COM-08653: Col0, Col1, Col2, Row0, Row1, Row2, Row3
RC522: IRQ, RST, SPI
TOUCH: SPI, IRQ

### Buses and harness runs
harness 9DOF? = sheet Perph/9DOF
harness ADC? = sheet Perph/ADC
harness COLORSENSOR? = sheet Perph/COLORSENSOR
harness DISPLAY? = sheet Perph/DISPLAY
harness ENCODER? = sheet Perph/ENCODER
harness GYROSCOPE? = sheet Perph/GYROSCOPE
harness KEYPAD? = sheet Perph/KEYPAD
harness RFID? = sheet Perph/RFID
harness RPi_GPIO? = sheet RPiCONN/GPIO
harness RPi_SPI1? = sheet RPiCONN/SPI1
harness RPi_SPI4? = sheet RPiCONN/SPI4
harness STEPMOTOR? = sheet Perph/STEPMOTOR
harness ULTRASONIC_HC0? = sheet Perph/ULTRASONIC_HC0
harness ULTRASONIC_HC1? = sheet Perph/ULTRASONIC_HC1

### Notes on the sheet
- (RPi_GPIO25)
- (RPi_GPIO5)
- (RPi_GPIO6)
- (RPi_GPIO7)
- (RPi_GPIO4)

## Sheet Var9.SchDoc
size A4; SheetNumber: 12; SheetTotal: 12
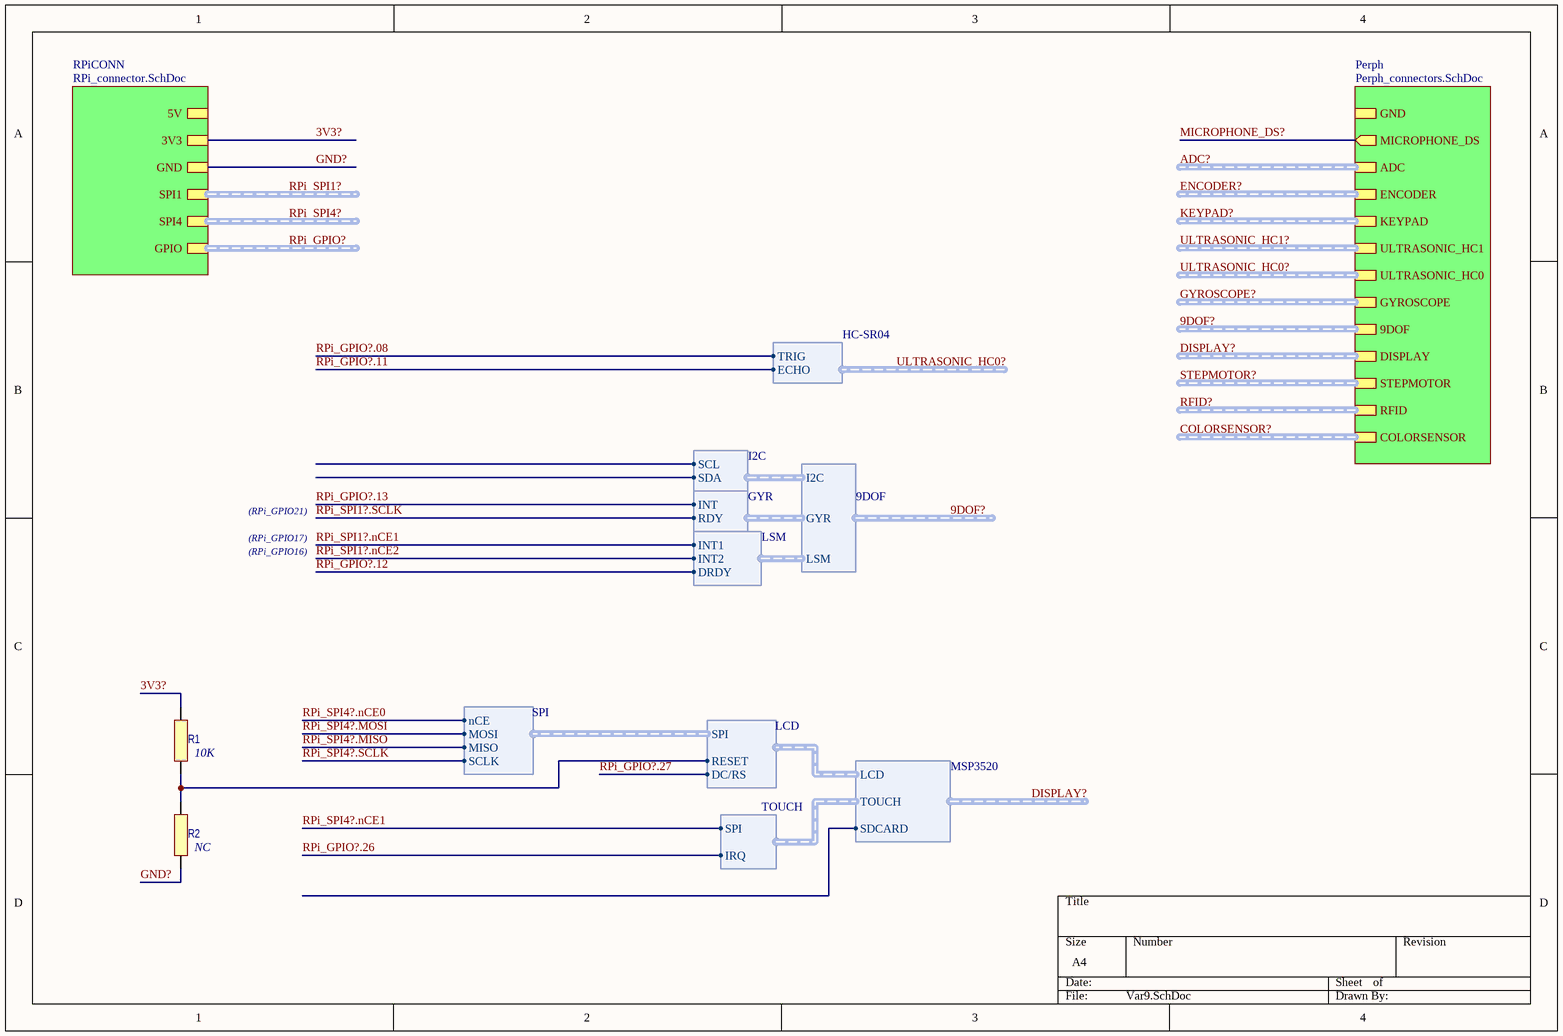
[diagram p11: Var9.SchDoc]

### Parts
R1  value 10K  [R0805]  (hidden comment: R0805)
R2  value NC  [R0805]  (hidden comment: R0805)

### Sub-sheets
Perph = Perph_connectors.SchDoc: MICROPHONE_DS (out), ADC (harness ADS1115 module), GYROSCOPE (harness GY-50 L3GD20 Gyro), ULTRASONIC_HC1 (harness HC-SR04), GND, KEYPAD (harness Keypad COM-08653), ULTRASONIC_HC0 (harness HC-SR04), DISPLAY (harness MSP3520), STEPMOTOR (harness ULN2003 Module), RFID (harness RC522), ENCODER (harness KY-040), COLORSENSOR (harness TCS34725), 9DOF (harness 9DOF)
RPiCONN = RPi_connector.SchDoc: 5V, 3V3, GND, SPI4 (harness SPI_2CS), SPI1 (harness SPI_3CS), GPIO (harness RPI_GPIO)

### Harnesses
SPI: nCE, MISO, MOSI, SCLK
LCD: SPI, RESET, DC/RS
TOUCH: SPI, IRQ
MSP3520: LCD, TOUCH, SDCARD
HC-SR04: ECHO, TRIG
I2C: SCL, SDA
9DOF: I2C, GYR, LSM
GYR: INT, RDY
LSM: INT1, DRDY, INT2

### Nets
3V3?: R1.1 ; sheet RPiCONN/3V3
GND?: R2.2 ; sheet RPiCONN/GND
MICROPHONE_DS?: sheet Perph/MICROPHONE_DS
RPi_GPIO?.08: sheet Perph/ULTRASONIC_HC0.TRIG
RPi_GPIO?.11: sheet Perph/ULTRASONIC_HC0.ECHO
RPi_GPIO?.12: harness LSM.DRDY
RPi_GPIO?.13: harness GYR.INT
RPi_GPIO?.26: harness TOUCH.IRQ
RPi_GPIO?.27: harness LCD.DC/RS
RPi_SPI1?.nCE1: harness LSM.INT1
RPi_SPI1?.nCE2: harness LSM.INT2
RPi_SPI1?.SCLK: harness GYR.RDY
RPi_SPI4?.MISO: harness SPI.MISO
RPi_SPI4?.MOSI: harness SPI.MOSI
RPi_SPI4?.nCE0: harness SPI.nCE
RPi_SPI4?.SCLK: harness SPI.SCLK
NetR1_2: R1.2 R2.1 ; harness LCD.RESET

### Buses and harness runs
harness 9DOF? = sheet Perph/9DOF
harness ADC? = sheet Perph/ADC
harness COLORSENSOR? = sheet Perph/COLORSENSOR
harness DISPLAY? = sheet Perph/DISPLAY
harness ENCODER? = sheet Perph/ENCODER
harness GYROSCOPE? = sheet Perph/GYROSCOPE
harness KEYPAD? = sheet Perph/KEYPAD
harness RFID? = sheet Perph/RFID
harness RPi_GPIO? = sheet RPiCONN/GPIO
harness RPi_SPI1? = sheet RPiCONN/SPI1
harness RPi_SPI4? = sheet RPiCONN/SPI4
harness STEPMOTOR? = sheet Perph/STEPMOTOR
harness ULTRASONIC_HC0? = sheet Perph/ULTRASONIC_HC0
harness ULTRASONIC_HC1? = sheet Perph/ULTRASONIC_HC1

### Notes on the sheet
- (RPi_GPIO21)
- (RPi_GPIO17)
- (RPi_GPIO16)

### Library data of the parts
R1 R2 = R0805: Case: *; Mount: *; PartNumber: *; Power: *; Tolerance: *

## Sheet Var10.SchDoc
size A4; SheetNumber: 13; SheetTotal: 13
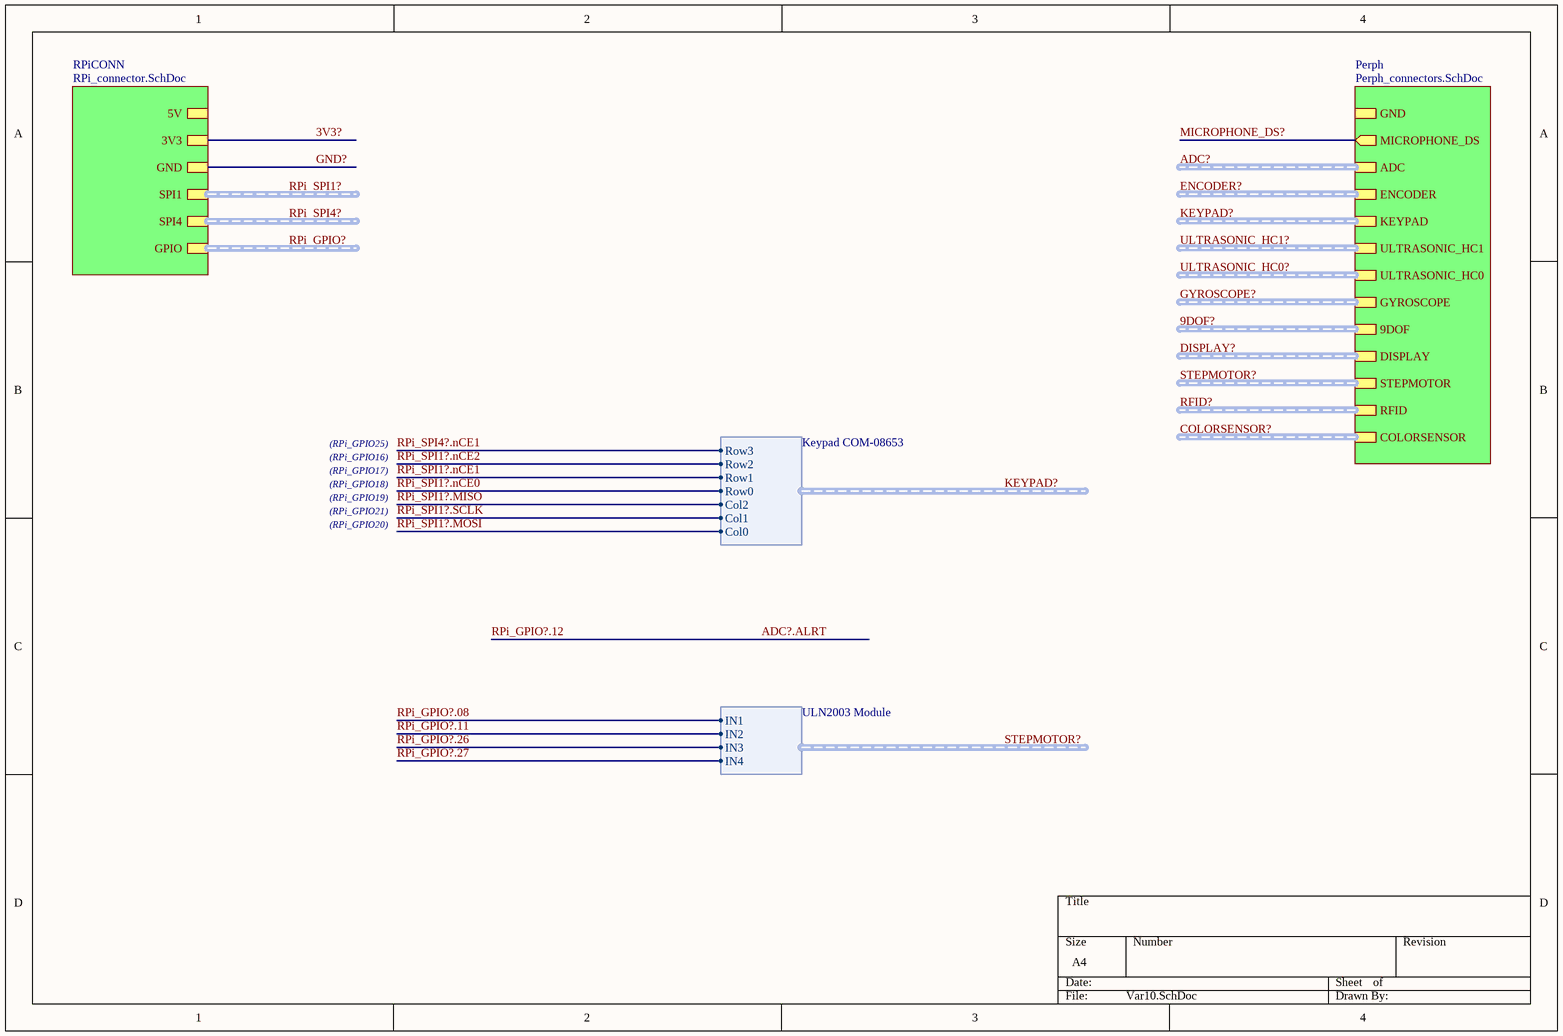
[diagram p12: Var10.SchDoc]

### Sub-sheets
Perph = Perph_connectors.SchDoc: MICROPHONE_DS (out), ADC (harness ADS1115 module), GYROSCOPE (harness GY-50 L3GD20 Gyro), ULTRASONIC_HC1 (harness HC-SR04), GND, KEYPAD (harness Keypad COM-08653), ULTRASONIC_HC0 (harness HC-SR04), DISPLAY (harness MSP3520), STEPMOTOR (harness ULN2003 Module), RFID (harness RC522), ENCODER (harness KY-040), COLORSENSOR (harness TCS34725), 9DOF (harness 9DOF)
RPiCONN = RPi_connector.SchDoc: 5V, 3V3, GND, SPI4 (harness SPI_2CS), SPI1 (harness SPI_3CS), GPIO (harness RPI_GPIO)

### Harnesses
Keypad COM-08653: Col0, Col1, Col2, Row0, Row1, Row2, Row3
ULN2003 Module: IN1, IN2, IN3, IN4

### Buses and harness runs
harness 9DOF? = sheet Perph/9DOF
harness ADC? = sheet Perph/ADC
harness COLORSENSOR? = sheet Perph/COLORSENSOR
harness DISPLAY? = sheet Perph/DISPLAY
harness ENCODER? = sheet Perph/ENCODER
harness GYROSCOPE? = sheet Perph/GYROSCOPE
harness KEYPAD? = sheet Perph/KEYPAD
harness RFID? = sheet Perph/RFID
harness RPi_GPIO? = sheet RPiCONN/GPIO
harness RPi_SPI1? = sheet RPiCONN/SPI1
harness RPi_SPI4? = sheet RPiCONN/SPI4
harness STEPMOTOR? = sheet Perph/STEPMOTOR
harness ULTRASONIC_HC0? = sheet Perph/ULTRASONIC_HC0
harness ULTRASONIC_HC1? = sheet Perph/ULTRASONIC_HC1

### Notes on the sheet
- (RPi_GPIO25)
- (RPi_GPIO21)
- (RPi_GPIO16)
- (RPi_GPIO17)
- (RPi_GPIO18)
- (RPi_GPIO19)
- (RPi_GPIO20)

## Nets that join several sheets
9DOF.GYR.INT: Variant 1/Perph (XS1_Perph1.9), Variant 2/Perph (XS1_Perph2.9), Variant 3/Perph (XS1_Perph3.9), Variant 4/Perph (XS1_Perph4.9), Variant 5/Perph (XS1_Perph5.9), Variant 6/Perph (XS1_Perph6.9), Variant 7/Perph (XS1_Perph7.9), Variant 8/Perph (XS1_Perph8.9), Variant 9/Perph (XS1_Perph9.9), Variant 10/Perph (XS1_Perph10.9)
9DOF.GYR.RDY: Variant 1/Perph (XS1_Perph1.10), Variant 2/Perph (XS1_Perph2.10), Variant 3/Perph (XS1_Perph3.10), Variant 4/Perph (XS1_Perph4.10), Variant 5/Perph (XS1_Perph5.10), Variant 6/Perph (XS1_Perph6.10), Variant 7/Perph (XS1_Perph7.10), Variant 8/Perph (XS1_Perph8.10), Variant 9/Perph (XS1_Perph9.10), Variant 10/Perph (XS1_Perph10.10)
9DOF.LSM.DRDY: Variant 1/Perph (XS1_Perph1.14), Variant 2/Perph (XS1_Perph2.14), Variant 3/Perph (XS1_Perph3.14), Variant 4/Perph (XS1_Perph4.14), Variant 5/Perph (XS1_Perph5.14), Variant 6/Perph (XS1_Perph6.14), Variant 7/Perph (XS1_Perph7.14), Variant 8/Perph (XS1_Perph8.14), Variant 9/Perph (XS1_Perph9.14), Variant 10/Perph (XS1_Perph10.14)
9DOF.LSM.INT1: Variant 1/Perph (XS1_Perph1.11), Variant 2/Perph (XS1_Perph2.11), Variant 3/Perph (XS1_Perph3.11), Variant 4/Perph (XS1_Perph4.11), Variant 5/Perph (XS1_Perph5.11), Variant 6/Perph (XS1_Perph6.11), Variant 7/Perph (XS1_Perph7.11), Variant 8/Perph (XS1_Perph8.11), Variant 9/Perph (XS1_Perph9.11), Variant 10/Perph (XS1_Perph10.11)
9DOF.LSM.INT2: Variant 1/Perph (XS1_Perph1.12), Variant 2/Perph (XS1_Perph2.12), Variant 3/Perph (XS1_Perph3.12), Variant 4/Perph (XS1_Perph4.12), Variant 5/Perph (XS1_Perph5.12), Variant 6/Perph (XS1_Perph6.12), Variant 7/Perph (XS1_Perph7.12), Variant 8/Perph (XS1_Perph8.12), Variant 9/Perph (XS1_Perph9.12), Variant 10/Perph (XS1_Perph10.12)
ADC.ALRT: Variant 1/Perph (XS2_Perph1.6), Variant 2/Perph (XS2_Perph2.6), Variant 3/Perph (XS2_Perph3.6), Variant 4/Perph (XS2_Perph4.6), Variant 5/Perph (XS2_Perph5.6), Variant 6/Perph (XS2_Perph6.6), Variant 7/Perph (XS2_Perph7.6), Variant 8/Perph (XS2_Perph8.6), Variant 9/Perph (XS2_Perph9.6), Variant 10/Perph (XS2_Perph10.6)
CLRSENS.INT: Variant 1/Perph (XS2_Perph1.5), Variant 2/Perph (XS2_Perph2.5), Variant 3/Perph (XS2_Perph3.5), Variant 4/Perph (XS2_Perph4.5), Variant 5/Perph (XS2_Perph5.5), Variant 6/Perph (XS2_Perph6.5), Variant 7/Perph (XS2_Perph7.5), Variant 8/Perph (XS2_Perph8.5), Variant 9/Perph (XS2_Perph9.5), Variant 10/Perph (XS2_Perph10.5)
DISPLAY.LCD.DC/RS: Variant 1/Perph (XS2_Perph1.33), Variant 2/Perph (XS2_Perph2.33), Variant 3/Perph (XS2_Perph3.33), Variant 4/Perph (XS2_Perph4.33), Variant 5/Perph (XS2_Perph5.33), Variant 6/Perph (XS2_Perph6.33), Variant 7/Perph (XS2_Perph7.33), Variant 8/Perph (XS2_Perph8.33), Variant 9/Perph (XS2_Perph9.33), Variant 10/Perph (XS2_Perph10.33)
DISPLAY.LCD.RESET: Variant 1/Perph (XS2_Perph1.34), Variant 2/Perph (XS2_Perph2.34), Variant 3/Perph (XS2_Perph3.34), Variant 4/Perph (XS2_Perph4.34), Variant 5/Perph (XS2_Perph5.34), Variant 6/Perph (XS2_Perph6.34), Variant 7/Perph (XS2_Perph7.34), Variant 8/Perph (XS2_Perph8.34), Variant 9/Perph (XS2_Perph9.34), Variant 10/Perph (XS2_Perph10.34)
DISPLAY.LCD.SPI.MISO: Variant 1/Perph (XS2_Perph1.37), Variant 2/Perph (XS2_Perph2.37), Variant 3/Perph (XS2_Perph3.37), Variant 4/Perph (XS2_Perph4.37), Variant 5/Perph (XS2_Perph5.37), Variant 6/Perph (XS2_Perph6.37), Variant 7/Perph (XS2_Perph7.37), Variant 8/Perph (XS2_Perph8.37), Variant 9/Perph (XS2_Perph9.37), Variant 10/Perph (XS2_Perph10.37)
DISPLAY.LCD.SPI.MOSI: Variant 1/Perph (XS2_Perph1.38), Variant 2/Perph (XS2_Perph2.38), Variant 3/Perph (XS2_Perph3.38), Variant 4/Perph (XS2_Perph4.38), Variant 5/Perph (XS2_Perph5.38), Variant 6/Perph (XS2_Perph6.38), Variant 7/Perph (XS2_Perph7.38), Variant 8/Perph (XS2_Perph8.38), Variant 9/Perph (XS2_Perph9.38), Variant 10/Perph (XS2_Perph10.38)
DISPLAY.LCD.SPI.nCE: Variant 1/Perph (XS2_Perph1.31), Variant 2/Perph (XS2_Perph2.31), Variant 3/Perph (XS2_Perph3.31), Variant 4/Perph (XS2_Perph4.31), Variant 5/Perph (XS2_Perph5.31), Variant 6/Perph (XS2_Perph6.31), Variant 7/Perph (XS2_Perph7.31), Variant 8/Perph (XS2_Perph8.31), Variant 9/Perph (XS2_Perph9.31), Variant 10/Perph (XS2_Perph10.31)
DISPLAY.LCD.SPI.SCLK: Variant 1/Perph (XS2_Perph1.36), Variant 2/Perph (XS2_Perph2.36), Variant 3/Perph (XS2_Perph3.36), Variant 4/Perph (XS2_Perph4.36), Variant 5/Perph (XS2_Perph5.36), Variant 6/Perph (XS2_Perph6.36), Variant 7/Perph (XS2_Perph7.36), Variant 8/Perph (XS2_Perph8.36), Variant 9/Perph (XS2_Perph9.36), Variant 10/Perph (XS2_Perph10.36)
DISPLAY.TOUCH.IRQ: Variant 1/Perph (XS2_Perph1.40), Variant 2/Perph (XS2_Perph2.40), Variant 3/Perph (XS2_Perph3.40), Variant 4/Perph (XS2_Perph4.40), Variant 5/Perph (XS2_Perph5.40), Variant 6/Perph (XS2_Perph6.40), Variant 7/Perph (XS2_Perph7.40), Variant 8/Perph (XS2_Perph8.40), Variant 9/Perph (XS2_Perph9.40), Variant 10/Perph (XS2_Perph10.40)
ENCODER.CLK: Variant 1/Perph (XS2_Perph1.12), Variant 2/Perph (XS2_Perph2.12), Variant 3/Perph (XS2_Perph3.12), Variant 4/Perph (XS2_Perph4.12), Variant 5/Perph (XS2_Perph5.12), Variant 6/Perph (XS2_Perph6.12), Variant 7/Perph (XS2_Perph7.12), Variant 8/Perph (XS2_Perph8.12), Variant 9/Perph (XS2_Perph9.12), Variant 10/Perph (XS2_Perph10.12)
ENCODER.DT: Variant 1/Perph (XS2_Perph1.11), Variant 2/Perph (XS2_Perph2.11), Variant 3/Perph (XS2_Perph3.11), Variant 4/Perph (XS2_Perph4.11), Variant 5/Perph (XS2_Perph5.11), Variant 6/Perph (XS2_Perph6.11), Variant 7/Perph (XS2_Perph7.11), Variant 8/Perph (XS2_Perph8.11), Variant 9/Perph (XS2_Perph9.11), Variant 10/Perph (XS2_Perph10.11)
ENCODER.SW: Variant 1/Perph (XS2_Perph1.10), Variant 2/Perph (XS2_Perph2.10), Variant 3/Perph (XS2_Perph3.10), Variant 4/Perph (XS2_Perph4.10), Variant 5/Perph (XS2_Perph5.10), Variant 6/Perph (XS2_Perph6.10), Variant 7/Perph (XS2_Perph7.10), Variant 8/Perph (XS2_Perph8.10), Variant 9/Perph (XS2_Perph9.10), Variant 10/Perph (XS2_Perph10.10)
GYROSCOPE.CS: Variant 1/Perph (XS1_Perph1.7), Variant 2/Perph (XS1_Perph2.7), Variant 3/Perph (XS1_Perph3.7), Variant 4/Perph (XS1_Perph4.7), Variant 5/Perph (XS1_Perph5.7), Variant 6/Perph (XS1_Perph6.7), Variant 7/Perph (XS1_Perph7.7), Variant 8/Perph (XS1_Perph8.7), Variant 9/Perph (XS1_Perph9.7), Variant 10/Perph (XS1_Perph10.7)
GYROSCOPE.DR: Variant 1/Perph (XS1_Perph1.6), Variant 2/Perph (XS1_Perph2.6), Variant 3/Perph (XS1_Perph3.6), Variant 4/Perph (XS1_Perph4.6), Variant 5/Perph (XS1_Perph5.6), Variant 6/Perph (XS1_Perph6.6), Variant 7/Perph (XS1_Perph7.6), Variant 8/Perph (XS1_Perph8.6), Variant 9/Perph (XS1_Perph9.6), Variant 10/Perph (XS1_Perph10.6)
GYROSCOPE.INT: Variant 1/Perph (XS1_Perph1.5), Variant 2/Perph (XS1_Perph2.5), Variant 3/Perph (XS1_Perph3.5), Variant 4/Perph (XS1_Perph4.5), Variant 5/Perph (XS1_Perph5.5), Variant 6/Perph (XS1_Perph6.5), Variant 7/Perph (XS1_Perph7.5), Variant 8/Perph (XS1_Perph8.5), Variant 9/Perph (XS1_Perph9.5), Variant 10/Perph (XS1_Perph10.5)
GYROSCOPE.SDO: Variant 1/Perph (XS1_Perph1.8), Variant 2/Perph (XS1_Perph2.8), Variant 3/Perph (XS1_Perph3.8), Variant 4/Perph (XS1_Perph4.8), Variant 5/Perph (XS1_Perph5.8), Variant 6/Perph (XS1_Perph6.8), Variant 7/Perph (XS1_Perph7.8), Variant 8/Perph (XS1_Perph8.8), Variant 9/Perph (XS1_Perph9.8), Variant 10/Perph (XS1_Perph10.8)
KEYPAD.Col0: Variant 1/Perph (XS2_Perph1.16), Variant 2/Perph (XS2_Perph2.16), Variant 3/Perph (XS2_Perph3.16), Variant 4/Perph (XS2_Perph4.16), Variant 5/Perph (XS2_Perph5.16), Variant 6/Perph (XS2_Perph6.16), Variant 7/Perph (XS2_Perph7.16), Variant 8/Perph (XS2_Perph8.16), Variant 9/Perph (XS2_Perph9.16), Variant 10/Perph (XS2_Perph10.16)
KEYPAD.Col1: Variant 1/Perph (XS2_Perph1.13), Variant 2/Perph (XS2_Perph2.13), Variant 3/Perph (XS2_Perph3.13), Variant 4/Perph (XS2_Perph4.13), Variant 5/Perph (XS2_Perph5.13), Variant 6/Perph (XS2_Perph6.13), Variant 7/Perph (XS2_Perph7.13), Variant 8/Perph (XS2_Perph8.13), Variant 9/Perph (XS2_Perph9.13), Variant 10/Perph (XS2_Perph10.13)
KEYPAD.Col2: Variant 1/Perph (XS2_Perph1.18), Variant 2/Perph (XS2_Perph2.18), Variant 3/Perph (XS2_Perph3.18), Variant 4/Perph (XS2_Perph4.18), Variant 5/Perph (XS2_Perph5.18), Variant 6/Perph (XS2_Perph6.18), Variant 7/Perph (XS2_Perph7.18), Variant 8/Perph (XS2_Perph8.18), Variant 9/Perph (XS2_Perph9.18), Variant 10/Perph (XS2_Perph10.18)
KEYPAD.Row0: Variant 1/Perph (XS2_Perph1.15), Variant 2/Perph (XS2_Perph2.15), Variant 3/Perph (XS2_Perph3.15), Variant 4/Perph (XS2_Perph4.15), Variant 5/Perph (XS2_Perph5.15), Variant 6/Perph (XS2_Perph6.15), Variant 7/Perph (XS2_Perph7.15), Variant 8/Perph (XS2_Perph8.15), Variant 9/Perph (XS2_Perph9.15), Variant 10/Perph (XS2_Perph10.15)
KEYPAD.Row1: Variant 1/Perph (XS2_Perph1.20), Variant 2/Perph (XS2_Perph2.20), Variant 3/Perph (XS2_Perph3.20), Variant 4/Perph (XS2_Perph4.20), Variant 5/Perph (XS2_Perph5.20), Variant 6/Perph (XS2_Perph6.20), Variant 7/Perph (XS2_Perph7.20), Variant 8/Perph (XS2_Perph8.20), Variant 9/Perph (XS2_Perph9.20), Variant 10/Perph (XS2_Perph10.20)
KEYPAD.Row2: Variant 1/Perph (XS2_Perph1.19), Variant 2/Perph (XS2_Perph2.19), Variant 3/Perph (XS2_Perph3.19), Variant 4/Perph (XS2_Perph4.19), Variant 5/Perph (XS2_Perph5.19), Variant 6/Perph (XS2_Perph6.19), Variant 7/Perph (XS2_Perph7.19), Variant 8/Perph (XS2_Perph8.19), Variant 9/Perph (XS2_Perph9.19), Variant 10/Perph (XS2_Perph10.19)
KEYPAD.Row3: Variant 1/Perph (XS2_Perph1.17), Variant 2/Perph (XS2_Perph2.17), Variant 3/Perph (XS2_Perph3.17), Variant 4/Perph (XS2_Perph4.17), Variant 5/Perph (XS2_Perph5.17), Variant 6/Perph (XS2_Perph6.17), Variant 7/Perph (XS2_Perph7.17), Variant 8/Perph (XS2_Perph8.17), Variant 9/Perph (XS2_Perph9.17), Variant 10/Perph (XS2_Perph10.17)
MICROPHONE_DS: Variant 1/Perph (XS2_Perph1.8), Variant 2/Perph (XS2_Perph2.8), Variant 3/Perph (XS2_Perph3.8), Variant 4/Perph (XS2_Perph4.8), Variant 5/Perph (XS2_Perph5.8), Variant 6/Perph (XS2_Perph6.8), Variant 7/Perph (XS2_Perph7.8), Variant 8/Perph (XS2_Perph8.8), Variant 9/Perph (XS2_Perph9.8), Variant 10/Perph (XS2_Perph10.8)
NetP1_RPiCONN1_1: Variant 1/RPiCONN (P1_RPiCONN1.1), Variant 2/RPiCONN (P1_RPiCONN2.1), Variant 3/RPiCONN (P1_RPiCONN3.1), Variant 4/RPiCONN (P1_RPiCONN4.1), Variant 5/RPiCONN (P1_RPiCONN5.1), Variant 6/RPiCONN (P1_RPiCONN6.1), Variant 7/RPiCONN (P1_RPiCONN7.1), Variant 8/RPiCONN (P1_RPiCONN8.1), Variant 9/RPiCONN (P1_RPiCONN9.1), Variant 10/RPiCONN (P1_RPiCONN10.1)
NetP1_RPiCONN1_2: Variant 1/RPiCONN (P1_RPiCONN1.2), Variant 2/RPiCONN (P1_RPiCONN2.2), Variant 3/RPiCONN (P1_RPiCONN3.2), Variant 4/RPiCONN (P1_RPiCONN4.2), Variant 5/RPiCONN (P1_RPiCONN5.2), Variant 6/RPiCONN (P1_RPiCONN6.2), Variant 7/RPiCONN (P1_RPiCONN7.2), Variant 8/RPiCONN (P1_RPiCONN8.2), Variant 9/RPiCONN (P1_RPiCONN9.2), Variant 10/RPiCONN (P1_RPiCONN10.2)
PGND: Variant 1/Perph (XS1_Perph1.13), Variant 1/RPiCONN (P1_RPiCONN1.15), Variant 2/RPiCONN (P1_RPiCONN2.15), Variant 2/Perph (XS1_Perph2.13), Variant 3/RPiCONN (P1_RPiCONN3.15), Variant 3/Perph (XS1_Perph3.13), Variant 4/RPiCONN (P1_RPiCONN4.15), Variant 4/Perph (XS1_Perph4.13), Variant 5/RPiCONN (P1_RPiCONN5.15), Variant 5/Perph (XS1_Perph5.13), Variant 6/RPiCONN (P1_RPiCONN6.15), Variant 6/Perph (XS1_Perph6.13), Variant 7/RPiCONN (P1_RPiCONN7.15), Variant 7/Perph (XS1_Perph7.13), Variant 8/RPiCONN (P1_RPiCONN8.15), Variant 8/Perph (XS1_Perph8.13), Variant 9/RPiCONN (P1_RPiCONN9.15), Variant 9/Perph (XS1_Perph9.13), Variant 10/RPiCONN (P1_RPiCONN10.15), Variant 10/Perph (XS1_Perph10.13)
RFID.IRQ: Variant 1/Perph (XS2_Perph1.25), Variant 2/Perph (XS2_Perph2.25), Variant 3/Perph (XS2_Perph3.25), Variant 4/Perph (XS2_Perph4.25), Variant 5/Perph (XS2_Perph5.25), Variant 6/Perph (XS2_Perph6.25), Variant 7/Perph (XS2_Perph7.25), Variant 8/Perph (XS2_Perph8.25), Variant 9/Perph (XS2_Perph9.25), Variant 10/Perph (XS2_Perph10.25)
RFID.RST: Variant 1/Perph (XS2_Perph1.26), Variant 2/Perph (XS2_Perph2.26), Variant 3/Perph (XS2_Perph3.26), Variant 4/Perph (XS2_Perph4.26), Variant 5/Perph (XS2_Perph5.26), Variant 6/Perph (XS2_Perph6.26), Variant 7/Perph (XS2_Perph7.26), Variant 8/Perph (XS2_Perph8.26), Variant 9/Perph (XS2_Perph9.26), Variant 10/Perph (XS2_Perph10.26)
RFID.SPI.MISO: Variant 1/Perph (XS2_Perph1.28), Variant 2/Perph (XS2_Perph2.28), Variant 3/Perph (XS2_Perph3.28), Variant 4/Perph (XS2_Perph4.28), Variant 5/Perph (XS2_Perph5.28), Variant 6/Perph (XS2_Perph6.28), Variant 7/Perph (XS2_Perph7.28), Variant 8/Perph (XS2_Perph8.28), Variant 9/Perph (XS2_Perph9.28), Variant 10/Perph (XS2_Perph10.28)
RFID.SPI.MOSI: Variant 1/Perph (XS2_Perph1.27), Variant 2/Perph (XS2_Perph2.27), Variant 3/Perph (XS2_Perph3.27), Variant 4/Perph (XS2_Perph4.27), Variant 5/Perph (XS2_Perph5.27), Variant 6/Perph (XS2_Perph6.27), Variant 7/Perph (XS2_Perph7.27), Variant 8/Perph (XS2_Perph8.27), Variant 9/Perph (XS2_Perph9.27), Variant 10/Perph (XS2_Perph10.27)
RFID.SPI.nCE: Variant 1/Perph (XS2_Perph1.29), Variant 2/Perph (XS2_Perph2.29), Variant 3/Perph (XS2_Perph3.29), Variant 4/Perph (XS2_Perph4.29), Variant 5/Perph (XS2_Perph5.29), Variant 6/Perph (XS2_Perph6.29), Variant 7/Perph (XS2_Perph7.29), Variant 8/Perph (XS2_Perph8.29), Variant 9/Perph (XS2_Perph9.29), Variant 10/Perph (XS2_Perph10.29)
RFID.SPI.SCLK: Variant 1/Perph (XS2_Perph1.30), Variant 2/Perph (XS2_Perph2.30), Variant 3/Perph (XS2_Perph3.30), Variant 4/Perph (XS2_Perph4.30), Variant 5/Perph (XS2_Perph5.30), Variant 6/Perph (XS2_Perph6.30), Variant 7/Perph (XS2_Perph7.30), Variant 8/Perph (XS2_Perph8.30), Variant 9/Perph (XS2_Perph9.30), Variant 10/Perph (XS2_Perph10.30)
RPi_GPIO.GPIO08: Variant 1/RPiCONN (P1_RPiCONN1.22), Variant 2/RPiCONN (P1_RPiCONN2.22), Variant 3/RPiCONN (P1_RPiCONN3.22), Variant 4/RPiCONN (P1_RPiCONN4.22), Variant 5/RPiCONN (P1_RPiCONN5.22), Variant 6/RPiCONN (P1_RPiCONN6.22), Variant 7/RPiCONN (P1_RPiCONN7.22), Variant 8/RPiCONN (P1_RPiCONN8.22), Variant 9/RPiCONN (P1_RPiCONN9.22), Variant 10/RPiCONN (P1_RPiCONN10.22)
RPi_GPIO.GPIO11: Variant 1/RPiCONN (P1_RPiCONN1.21), Variant 2/RPiCONN (P1_RPiCONN2.21), Variant 3/RPiCONN (P1_RPiCONN3.21), Variant 4/RPiCONN (P1_RPiCONN4.21), Variant 5/RPiCONN (P1_RPiCONN5.21), Variant 6/RPiCONN (P1_RPiCONN6.21), Variant 7/RPiCONN (P1_RPiCONN7.21), Variant 8/RPiCONN (P1_RPiCONN8.21), Variant 9/RPiCONN (P1_RPiCONN9.21), Variant 10/RPiCONN (P1_RPiCONN10.21)
RPi_GPIO.GPIO12: Variant 1/RPiCONN (P1_RPiCONN1.17), Variant 2/RPiCONN (P1_RPiCONN2.17), Variant 3/RPiCONN (P1_RPiCONN3.17), Variant 4/RPiCONN (P1_RPiCONN4.17), Variant 5/RPiCONN (P1_RPiCONN5.17), Variant 6/RPiCONN (P1_RPiCONN6.17), Variant 7/RPiCONN (P1_RPiCONN7.17), Variant 8/RPiCONN (P1_RPiCONN8.17), Variant 9/RPiCONN (P1_RPiCONN9.17), Variant 10/RPiCONN (P1_RPiCONN10.17)
RPi_GPIO.GPIO13: Variant 1/RPiCONN (P1_RPiCONN1.18), Variant 2/RPiCONN (P1_RPiCONN2.18), Variant 3/RPiCONN (P1_RPiCONN3.18), Variant 4/RPiCONN (P1_RPiCONN4.18), Variant 5/RPiCONN (P1_RPiCONN5.18), Variant 6/RPiCONN (P1_RPiCONN6.18), Variant 7/RPiCONN (P1_RPiCONN7.18), Variant 8/RPiCONN (P1_RPiCONN8.18), Variant 9/RPiCONN (P1_RPiCONN9.18), Variant 10/RPiCONN (P1_RPiCONN10.18)
RPi_GPIO.GPIO26: Variant 1/RPiCONN (P1_RPiCONN1.20), Variant 2/RPiCONN (P1_RPiCONN2.20), Variant 3/RPiCONN (P1_RPiCONN3.20), Variant 4/RPiCONN (P1_RPiCONN4.20), Variant 5/RPiCONN (P1_RPiCONN5.20), Variant 6/RPiCONN (P1_RPiCONN6.20), Variant 7/RPiCONN (P1_RPiCONN7.20), Variant 8/RPiCONN (P1_RPiCONN8.20), Variant 9/RPiCONN (P1_RPiCONN9.20), Variant 10/RPiCONN (P1_RPiCONN10.20)
RPi_GPIO.GPIO27: Variant 1/RPiCONN (P1_RPiCONN1.19), Variant 2/RPiCONN (P1_RPiCONN2.19), Variant 3/RPiCONN (P1_RPiCONN3.19), Variant 4/RPiCONN (P1_RPiCONN4.19), Variant 5/RPiCONN (P1_RPiCONN5.19), Variant 6/RPiCONN (P1_RPiCONN6.19), Variant 7/RPiCONN (P1_RPiCONN7.19), Variant 8/RPiCONN (P1_RPiCONN8.19), Variant 9/RPiCONN (P1_RPiCONN9.19), Variant 10/RPiCONN (P1_RPiCONN10.19)
RPi_SPI1.MISO: Variant 1/RPiCONN (P1_RPiCONN1.10), Variant 2/RPiCONN (P1_RPiCONN2.10), Variant 3/RPiCONN (P1_RPiCONN3.10), Variant 4/RPiCONN (P1_RPiCONN4.10), Variant 5/RPiCONN (P1_RPiCONN5.10), Variant 6/RPiCONN (P1_RPiCONN6.10), Variant 7/RPiCONN (P1_RPiCONN7.10), Variant 8/RPiCONN (P1_RPiCONN8.10), Variant 9/RPiCONN (P1_RPiCONN9.10), Variant 10/RPiCONN (P1_RPiCONN10.10)
RPi_SPI1.MOSI: Variant 1/RPiCONN (P1_RPiCONN1.9), Variant 2/RPiCONN (P1_RPiCONN2.9), Variant 3/RPiCONN (P1_RPiCONN3.9), Variant 4/RPiCONN (P1_RPiCONN4.9), Variant 5/RPiCONN (P1_RPiCONN5.9), Variant 6/RPiCONN (P1_RPiCONN6.9), Variant 7/RPiCONN (P1_RPiCONN7.9), Variant 8/RPiCONN (P1_RPiCONN8.9), Variant 9/RPiCONN (P1_RPiCONN9.9), Variant 10/RPiCONN (P1_RPiCONN10.9)
RPi_SPI1.nCE0: Variant 1/RPiCONN (P1_RPiCONN1.7), Variant 2/RPiCONN (P1_RPiCONN2.7), Variant 3/RPiCONN (P1_RPiCONN3.7), Variant 4/RPiCONN (P1_RPiCONN4.7), Variant 5/RPiCONN (P1_RPiCONN5.7), Variant 6/RPiCONN (P1_RPiCONN6.7), Variant 7/RPiCONN (P1_RPiCONN7.7), Variant 8/RPiCONN (P1_RPiCONN8.7), Variant 9/RPiCONN (P1_RPiCONN9.7), Variant 10/RPiCONN (P1_RPiCONN10.7)
RPi_SPI1.nCE1: Variant 1/RPiCONN (P1_RPiCONN1.5), Variant 2/RPiCONN (P1_RPiCONN2.5), Variant 3/RPiCONN (P1_RPiCONN3.5), Variant 4/RPiCONN (P1_RPiCONN4.5), Variant 5/RPiCONN (P1_RPiCONN5.5), Variant 6/RPiCONN (P1_RPiCONN6.5), Variant 7/RPiCONN (P1_RPiCONN7.5), Variant 8/RPiCONN (P1_RPiCONN8.5), Variant 9/RPiCONN (P1_RPiCONN9.5), Variant 10/RPiCONN (P1_RPiCONN10.5)
RPi_SPI1.nCE2: Variant 1/RPiCONN (P1_RPiCONN1.6), Variant 2/RPiCONN (P1_RPiCONN2.6), Variant 3/RPiCONN (P1_RPiCONN3.6), Variant 4/RPiCONN (P1_RPiCONN4.6), Variant 5/RPiCONN (P1_RPiCONN5.6), Variant 6/RPiCONN (P1_RPiCONN6.6), Variant 7/RPiCONN (P1_RPiCONN7.6), Variant 8/RPiCONN (P1_RPiCONN8.6), Variant 9/RPiCONN (P1_RPiCONN9.6), Variant 10/RPiCONN (P1_RPiCONN10.6)
RPi_SPI1.SCLK: Variant 1/RPiCONN (P1_RPiCONN1.8), Variant 2/RPiCONN (P1_RPiCONN2.8), Variant 3/RPiCONN (P1_RPiCONN3.8), Variant 4/RPiCONN (P1_RPiCONN4.8), Variant 5/RPiCONN (P1_RPiCONN5.8), Variant 6/RPiCONN (P1_RPiCONN6.8), Variant 7/RPiCONN (P1_RPiCONN7.8), Variant 8/RPiCONN (P1_RPiCONN8.8), Variant 9/RPiCONN (P1_RPiCONN9.8), Variant 10/RPiCONN (P1_RPiCONN10.8)
RPi_SPI4.MISO: Variant 1/RPiCONN (P1_RPiCONN1.13), Variant 2/RPiCONN (P1_RPiCONN2.13), Variant 3/RPiCONN (P1_RPiCONN3.13), Variant 4/RPiCONN (P1_RPiCONN4.13), Variant 5/RPiCONN (P1_RPiCONN5.13), Variant 6/RPiCONN (P1_RPiCONN6.13), Variant 7/RPiCONN (P1_RPiCONN7.13), Variant 8/RPiCONN (P1_RPiCONN8.13), Variant 9/RPiCONN (P1_RPiCONN9.13), Variant 10/RPiCONN (P1_RPiCONN10.13)
RPi_SPI4.MOSI: Variant 1/RPiCONN (P1_RPiCONN1.16), Variant 2/RPiCONN (P1_RPiCONN2.16), Variant 3/RPiCONN (P1_RPiCONN3.16), Variant 4/RPiCONN (P1_RPiCONN4.16), Variant 5/RPiCONN (P1_RPiCONN5.16), Variant 6/RPiCONN (P1_RPiCONN6.16), Variant 7/RPiCONN (P1_RPiCONN7.16), Variant 8/RPiCONN (P1_RPiCONN8.16), Variant 9/RPiCONN (P1_RPiCONN9.16), Variant 10/RPiCONN (P1_RPiCONN10.16)
RPi_SPI4.nCE0: Variant 1/RPiCONN (P1_RPiCONN1.11), Variant 2/RPiCONN (P1_RPiCONN2.11), Variant 3/RPiCONN (P1_RPiCONN3.11), Variant 4/RPiCONN (P1_RPiCONN4.11), Variant 5/RPiCONN (P1_RPiCONN5.11), Variant 6/RPiCONN (P1_RPiCONN6.11), Variant 7/RPiCONN (P1_RPiCONN7.11), Variant 8/RPiCONN (P1_RPiCONN8.11), Variant 9/RPiCONN (P1_RPiCONN9.11), Variant 10/RPiCONN (P1_RPiCONN10.11)
RPi_SPI4.nCE1: Variant 1/RPiCONN (P1_RPiCONN1.12), Variant 2/RPiCONN (P1_RPiCONN2.12), Variant 3/RPiCONN (P1_RPiCONN3.12), Variant 4/RPiCONN (P1_RPiCONN4.12), Variant 5/RPiCONN (P1_RPiCONN5.12), Variant 6/RPiCONN (P1_RPiCONN6.12), Variant 7/RPiCONN (P1_RPiCONN7.12), Variant 8/RPiCONN (P1_RPiCONN8.12), Variant 9/RPiCONN (P1_RPiCONN9.12), Variant 10/RPiCONN (P1_RPiCONN10.12)
RPi_SPI4.SCLK: Variant 1/RPiCONN (P1_RPiCONN1.14), Variant 2/RPiCONN (P1_RPiCONN2.14), Variant 3/RPiCONN (P1_RPiCONN3.14), Variant 4/RPiCONN (P1_RPiCONN4.14), Variant 5/RPiCONN (P1_RPiCONN5.14), Variant 6/RPiCONN (P1_RPiCONN6.14), Variant 7/RPiCONN (P1_RPiCONN7.14), Variant 8/RPiCONN (P1_RPiCONN8.14), Variant 9/RPiCONN (P1_RPiCONN9.14), Variant 10/RPiCONN (P1_RPiCONN10.14)
STEPMOTOR.IN1: Variant 1/Perph (XS1_Perph1.4), Variant 2/Perph (XS1_Perph2.4), Variant 3/Perph (XS1_Perph3.4), Variant 4/Perph (XS1_Perph4.4), Variant 5/Perph (XS1_Perph5.4), Variant 6/Perph (XS1_Perph6.4), Variant 7/Perph (XS1_Perph7.4), Variant 8/Perph (XS1_Perph8.4), Variant 9/Perph (XS1_Perph9.4), Variant 10/Perph (XS1_Perph10.4)
STEPMOTOR.IN2: Variant 1/Perph (XS1_Perph1.3), Variant 2/Perph (XS1_Perph2.3), Variant 3/Perph (XS1_Perph3.3), Variant 4/Perph (XS1_Perph4.3), Variant 5/Perph (XS1_Perph5.3), Variant 6/Perph (XS1_Perph6.3), Variant 7/Perph (XS1_Perph7.3), Variant 8/Perph (XS1_Perph8.3), Variant 9/Perph (XS1_Perph9.3), Variant 10/Perph (XS1_Perph10.3)
STEPMOTOR.IN3: Variant 1/Perph (XS1_Perph1.2), Variant 2/Perph (XS1_Perph2.2), Variant 3/Perph (XS1_Perph3.2), Variant 4/Perph (XS1_Perph4.2), Variant 5/Perph (XS1_Perph5.2), Variant 6/Perph (XS1_Perph6.2), Variant 7/Perph (XS1_Perph7.2), Variant 8/Perph (XS1_Perph8.2), Variant 9/Perph (XS1_Perph9.2), Variant 10/Perph (XS1_Perph10.2)
STEPMOTOR.IN4: Variant 1/Perph (XS1_Perph1.1), Variant 2/Perph (XS1_Perph2.1), Variant 3/Perph (XS1_Perph3.1), Variant 4/Perph (XS1_Perph4.1), Variant 5/Perph (XS1_Perph5.1), Variant 6/Perph (XS1_Perph6.1), Variant 7/Perph (XS1_Perph7.1), Variant 8/Perph (XS1_Perph8.1), Variant 9/Perph (XS1_Perph9.1), Variant 10/Perph (XS1_Perph10.1)
ULTRASONIC_HC0.ECHO: Variant 1/Perph (XS2_Perph1.24), Variant 2/Perph (XS2_Perph2.24), Variant 3/Perph (XS2_Perph3.24), Variant 4/Perph (XS2_Perph4.24), Variant 5/Perph (XS2_Perph5.24), Variant 6/Perph (XS2_Perph6.24), Variant 7/Perph (XS2_Perph7.24), Variant 8/Perph (XS2_Perph8.24), Variant 9/Perph (XS2_Perph9.24), Variant 10/Perph (XS2_Perph10.24)
ULTRASONIC_HC0.TRIG: Variant 1/Perph (XS2_Perph1.23), Variant 2/Perph (XS2_Perph2.23), Variant 3/Perph (XS2_Perph3.23), Variant 4/Perph (XS2_Perph4.23), Variant 5/Perph (XS2_Perph5.23), Variant 6/Perph (XS2_Perph6.23), Variant 7/Perph (XS2_Perph7.23), Variant 8/Perph (XS2_Perph8.23), Variant 9/Perph (XS2_Perph9.23), Variant 10/Perph (XS2_Perph10.23)
ULTRASONIC_HC1.ECHO: Variant 1/Perph (XS2_Perph1.21), Variant 2/Perph (XS2_Perph2.21), Variant 3/Perph (XS2_Perph3.21), Variant 4/Perph (XS2_Perph4.21), Variant 5/Perph (XS2_Perph5.21), Variant 6/Perph (XS2_Perph6.21), Variant 7/Perph (XS2_Perph7.21), Variant 8/Perph (XS2_Perph8.21), Variant 9/Perph (XS2_Perph9.21), Variant 10/Perph (XS2_Perph10.21)
ULTRASONIC_HC1.TRIG: Variant 1/Perph (XS2_Perph1.22), Variant 2/Perph (XS2_Perph2.22), Variant 3/Perph (XS2_Perph3.22), Variant 4/Perph (XS2_Perph4.22), Variant 5/Perph (XS2_Perph5.22), Variant 6/Perph (XS2_Perph6.22), Variant 7/Perph (XS2_Perph7.22), Variant 8/Perph (XS2_Perph8.22), Variant 9/Perph (XS2_Perph9.22), Variant 10/Perph (XS2_Perph10.22)